# EAGLE design SensorBoard (EAGLE 6.4)
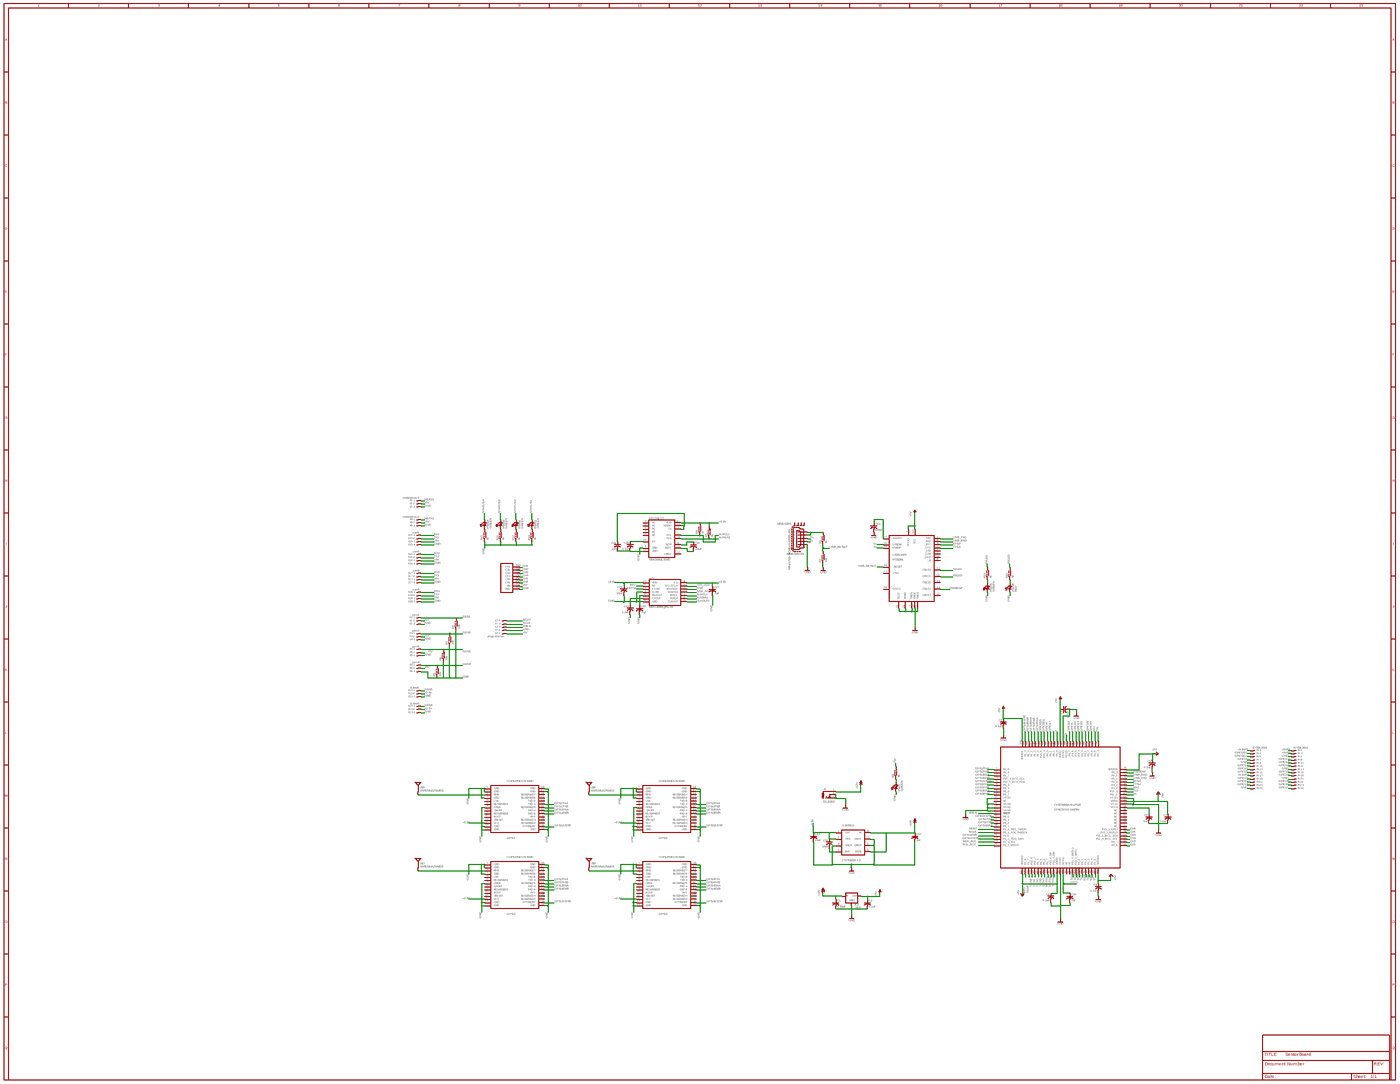
[diagram p0: schematic, sheet 1, overview]
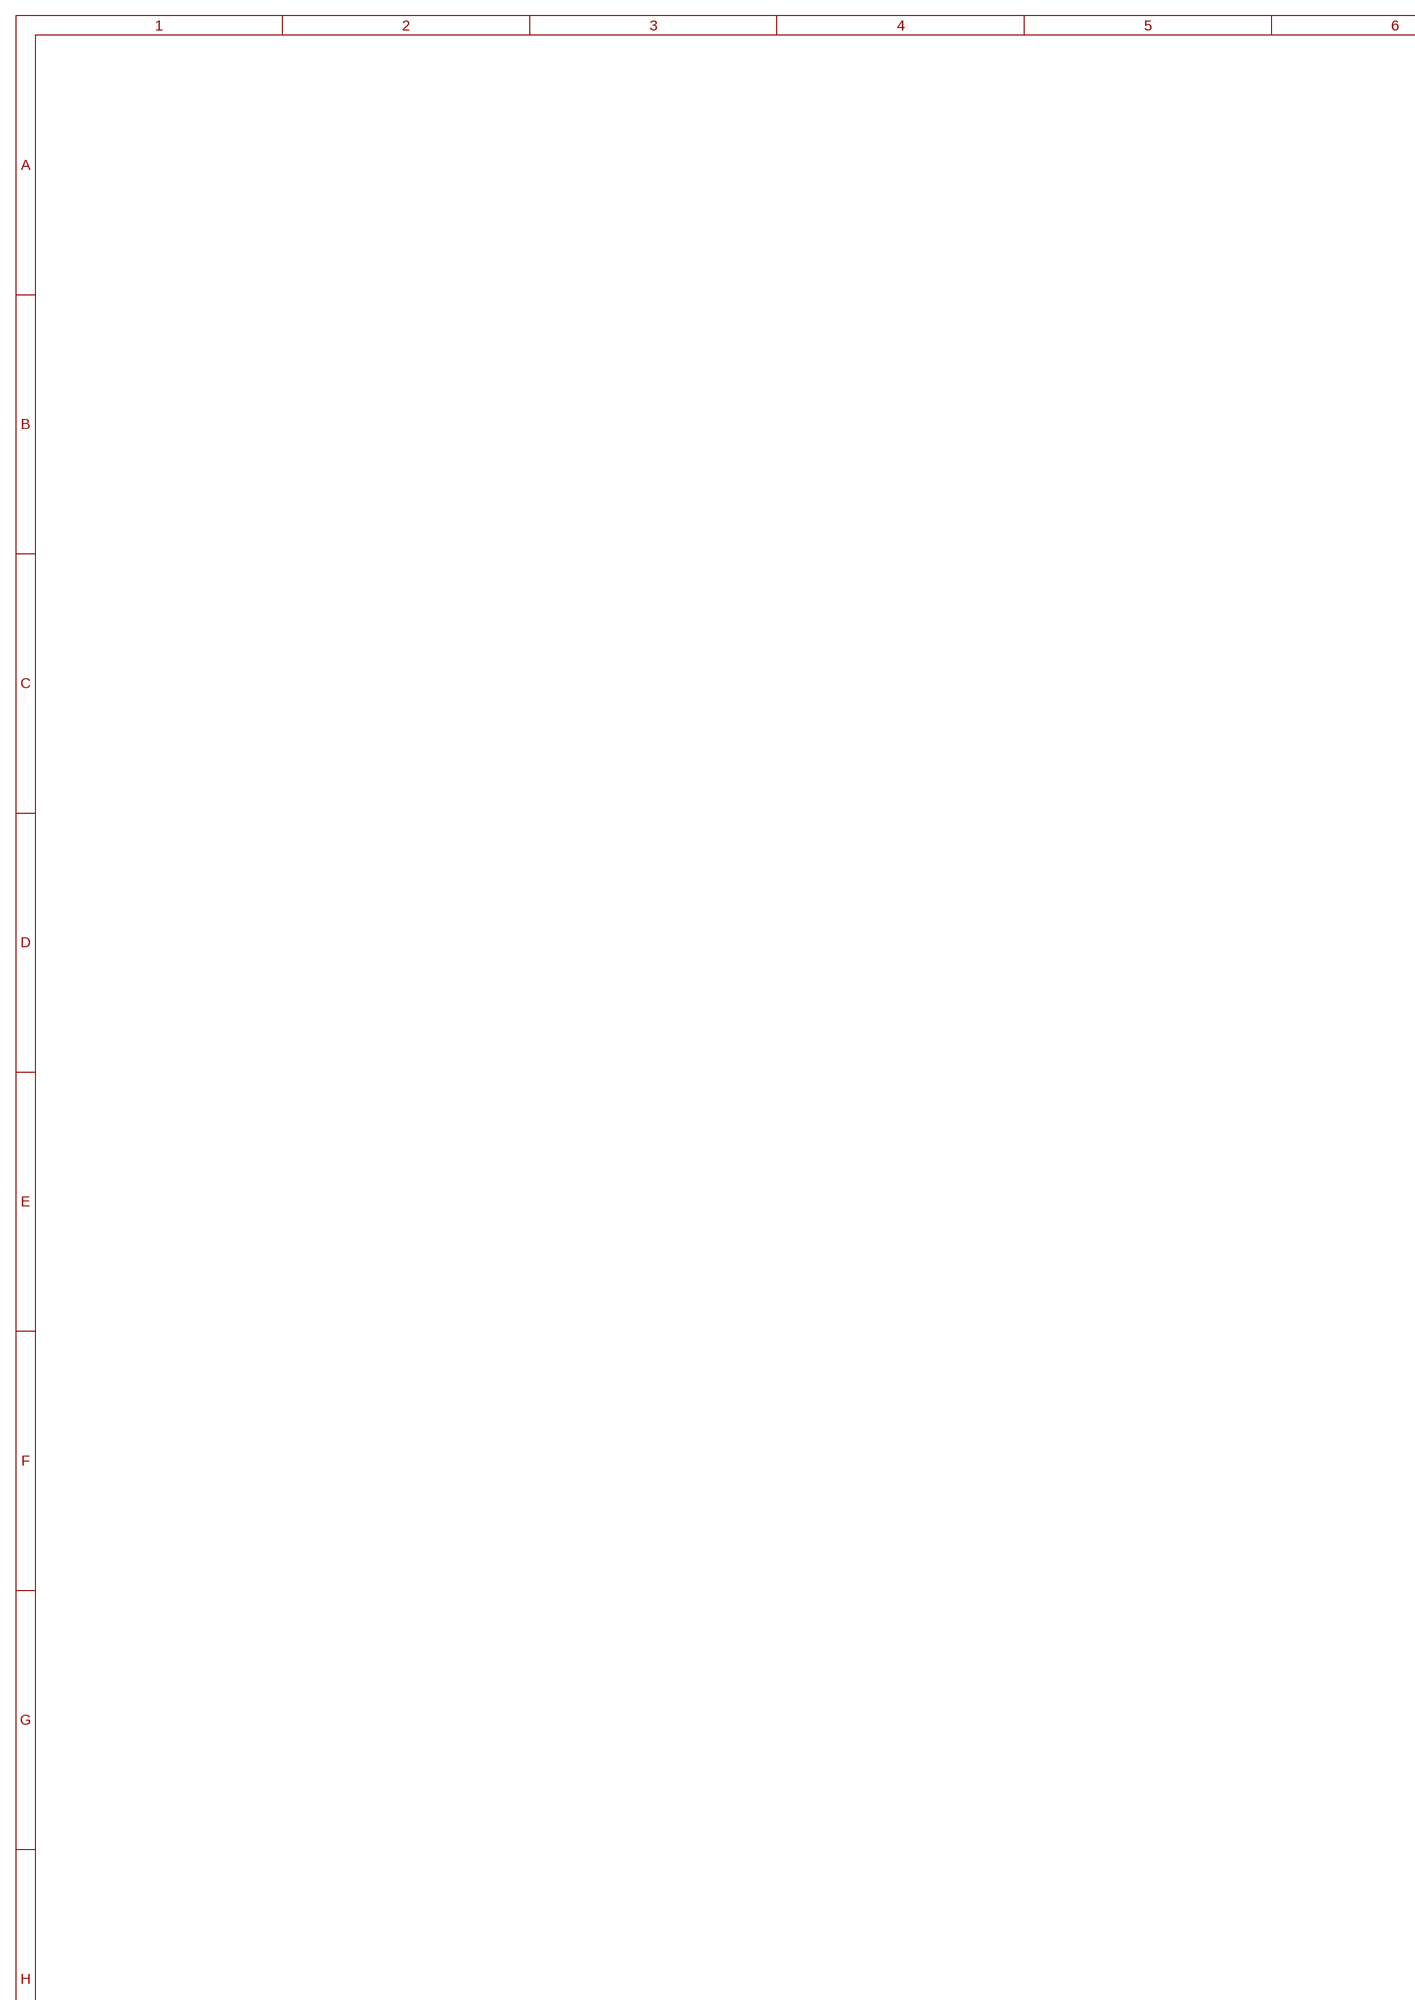
[diagram p1: schematic, sheet 1, part 1 of 8]
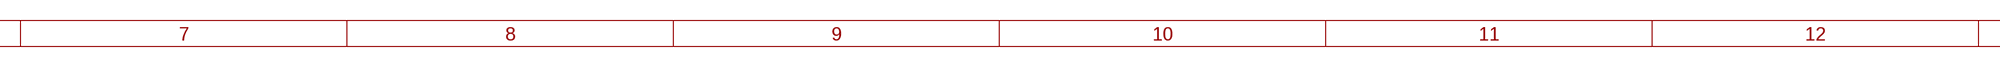
[diagram p2: schematic, sheet 1, part 2 of 8]
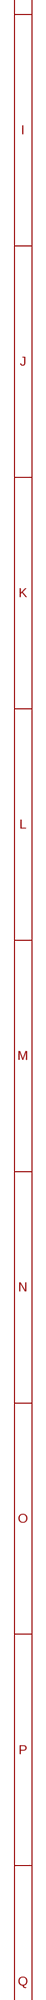
[diagram p3: schematic, sheet 1, part 3 of 8]
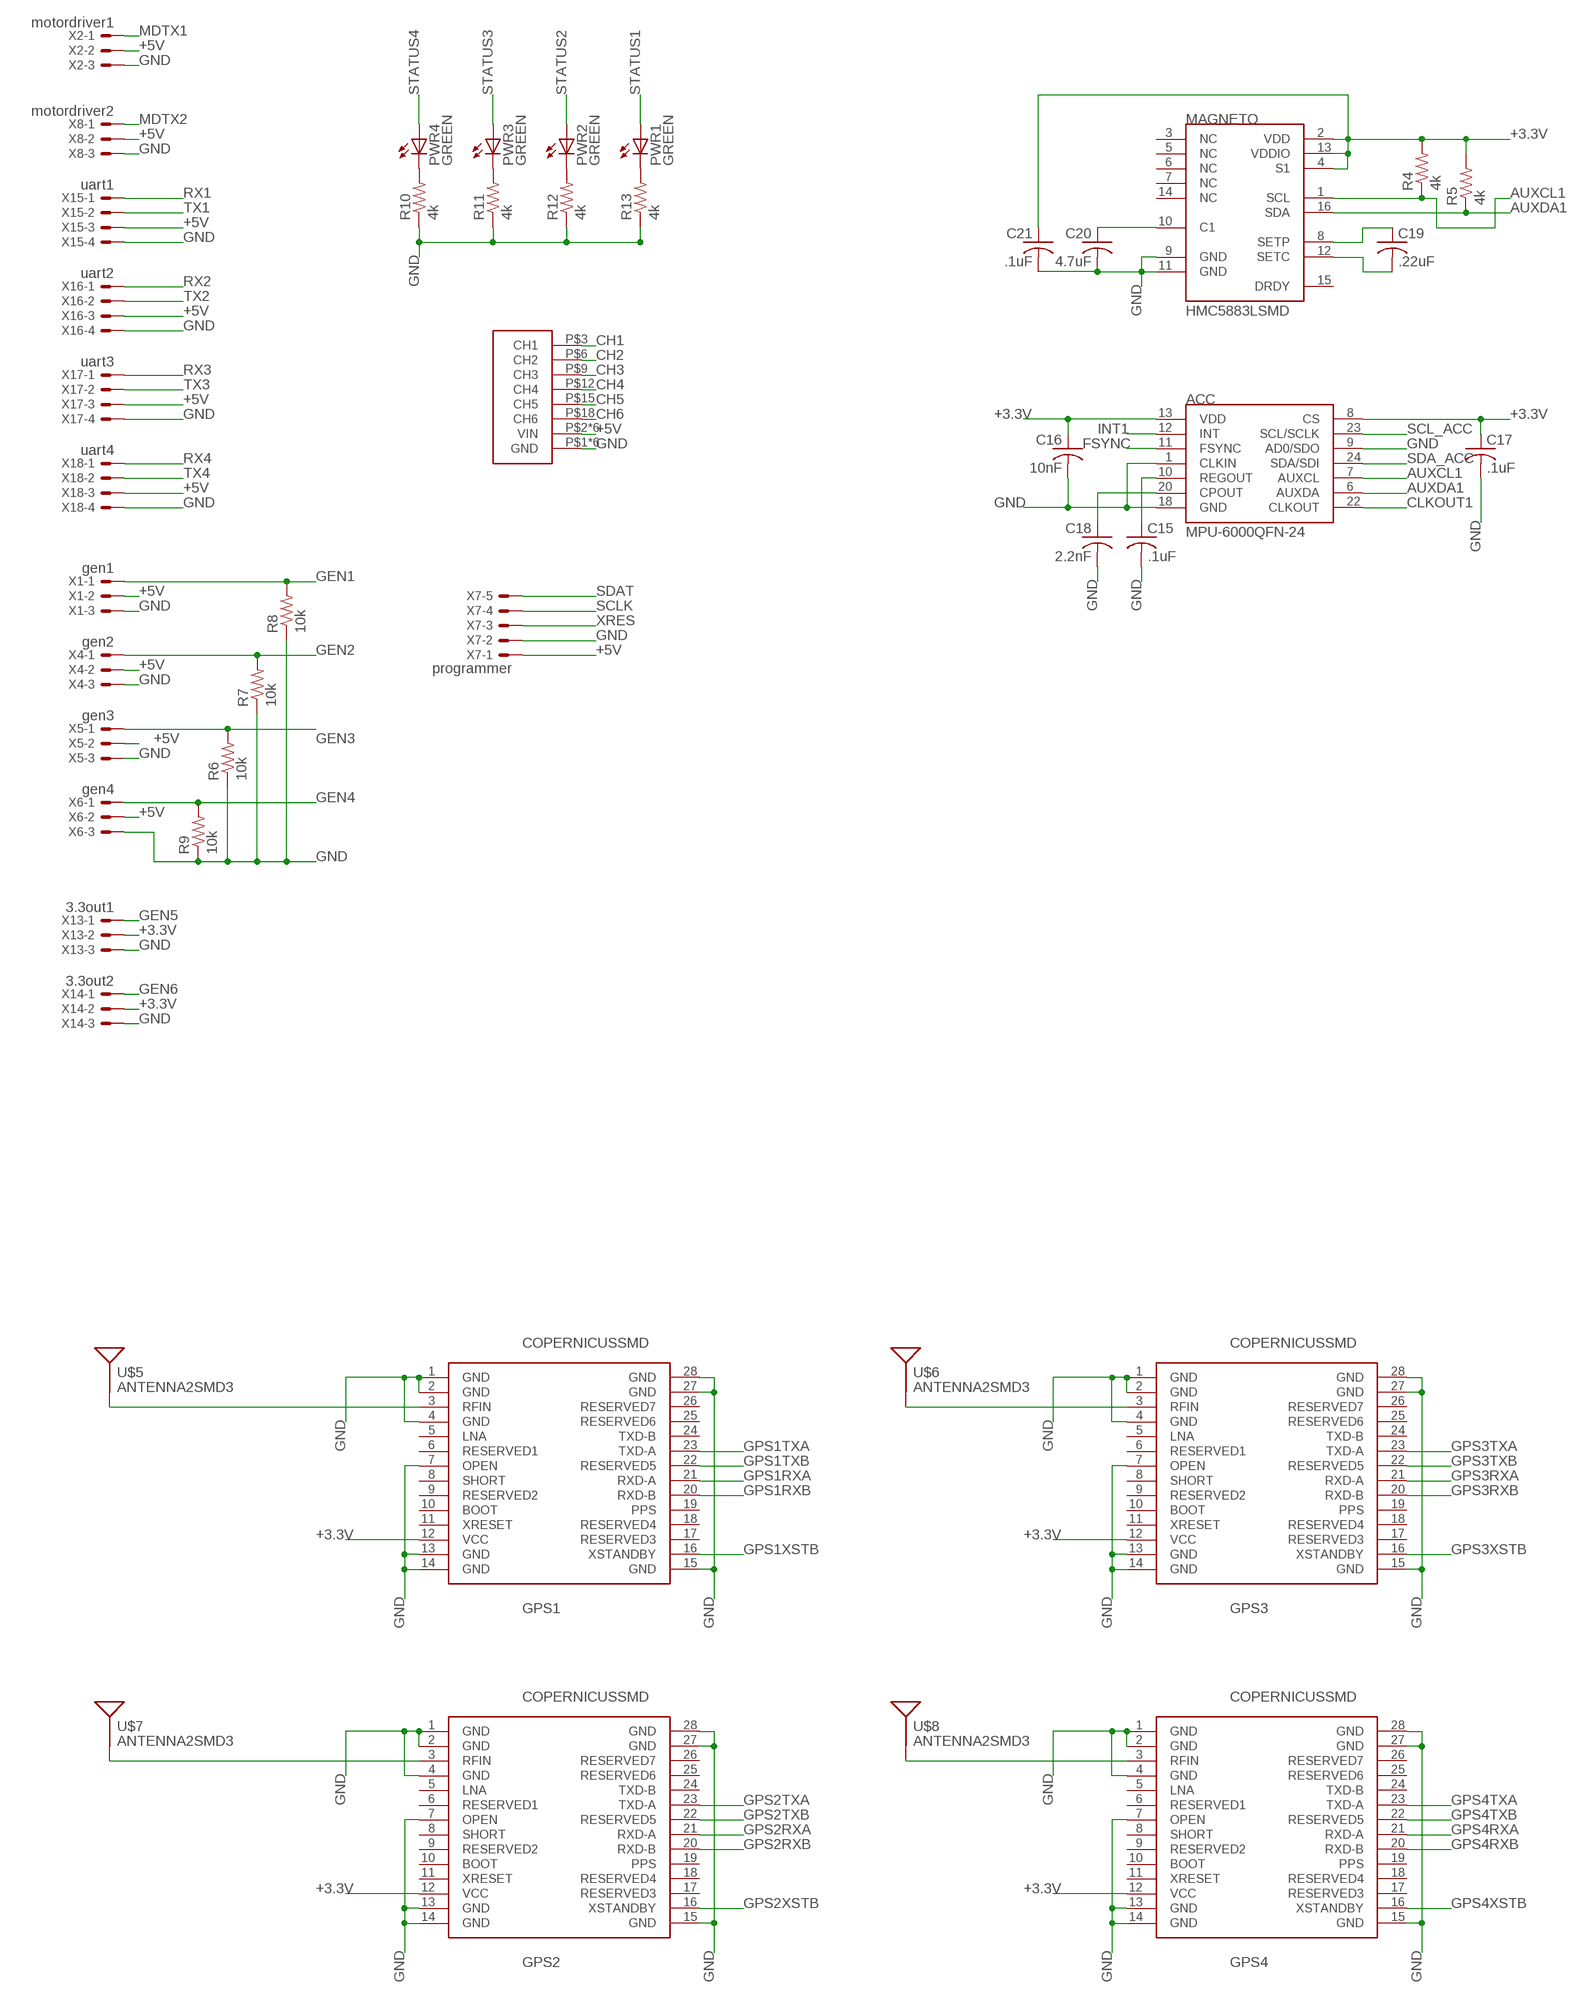
[diagram p4: schematic, sheet 1, part 4 of 8]
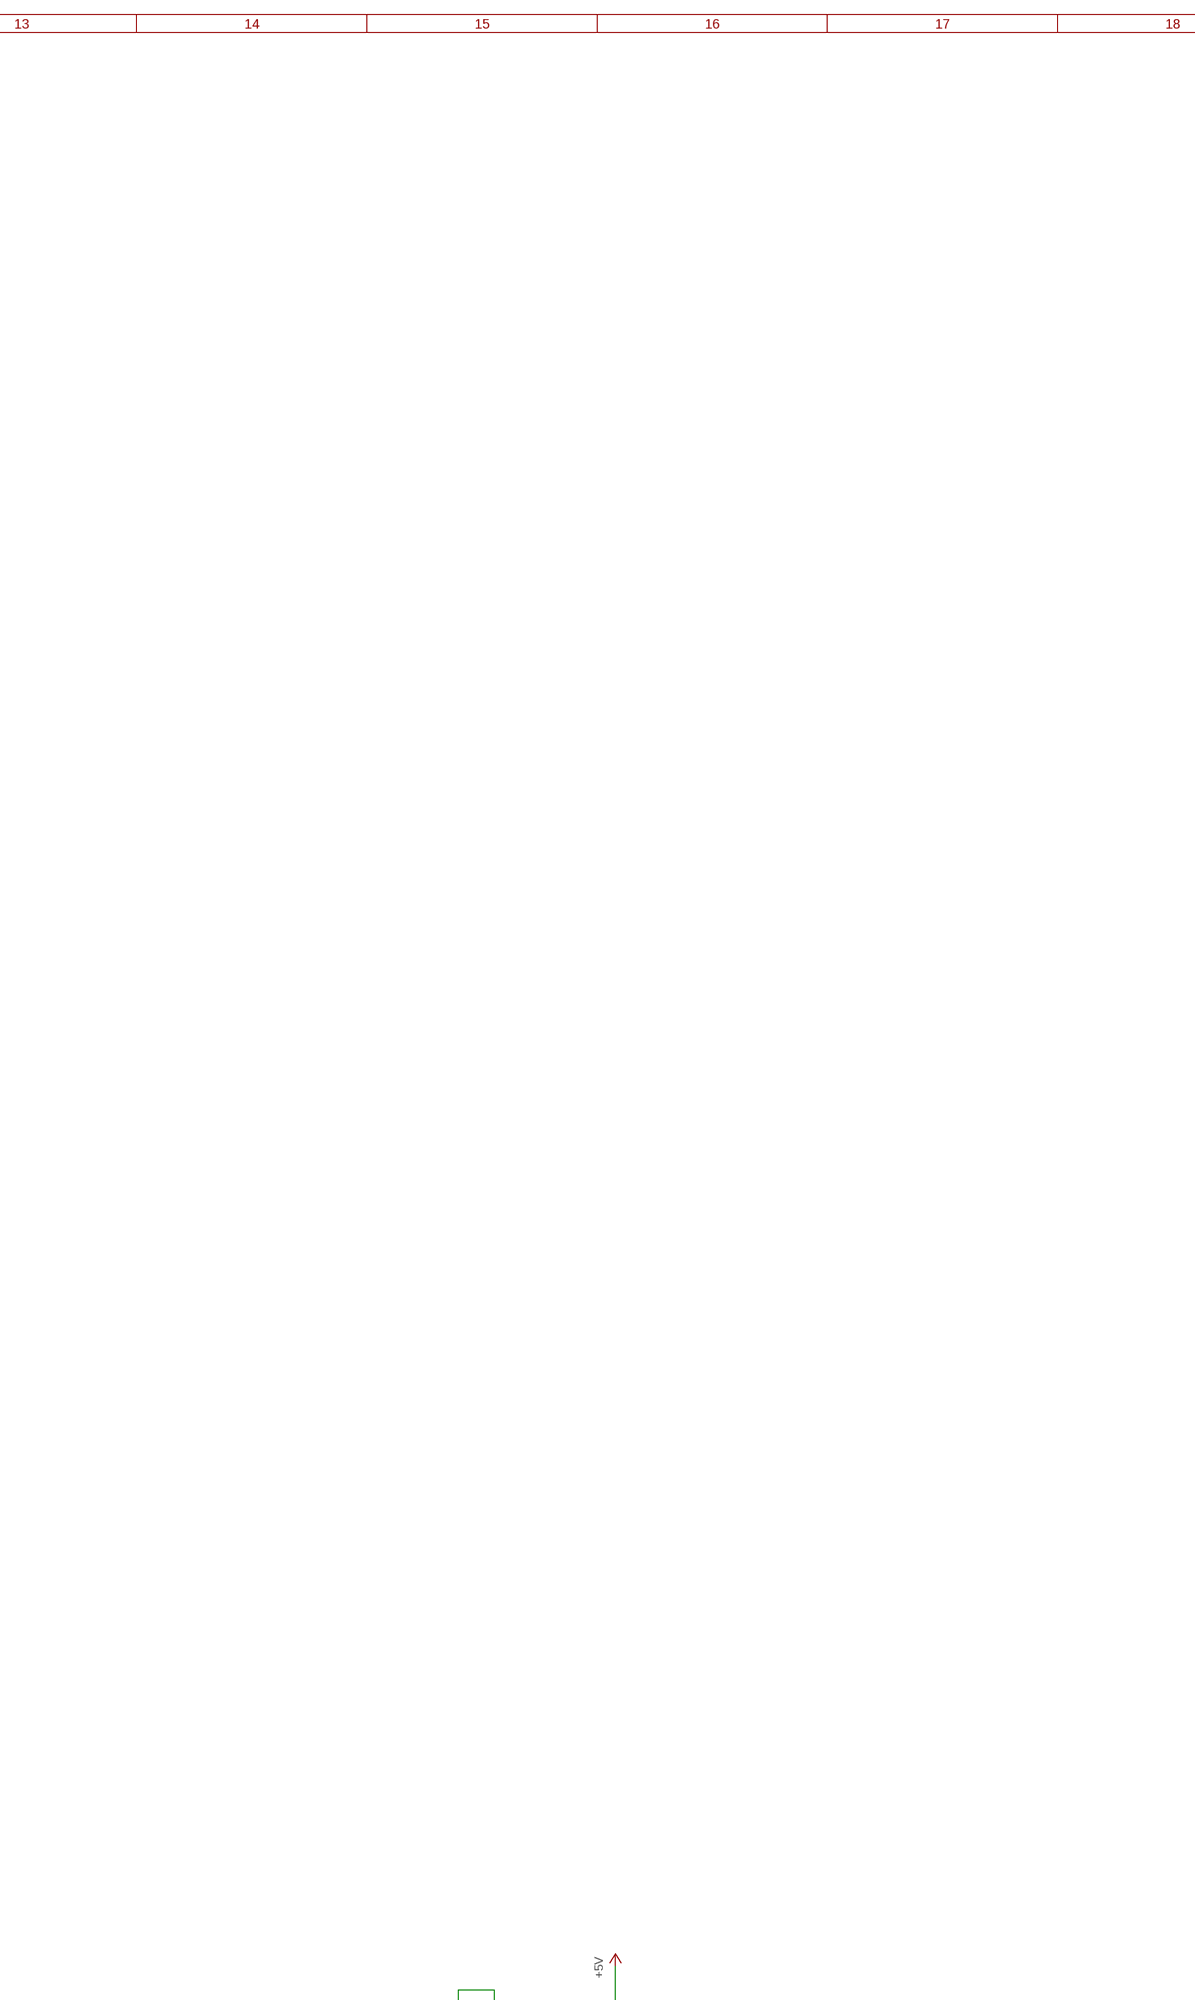
[diagram p5: schematic, sheet 1, part 5 of 8]
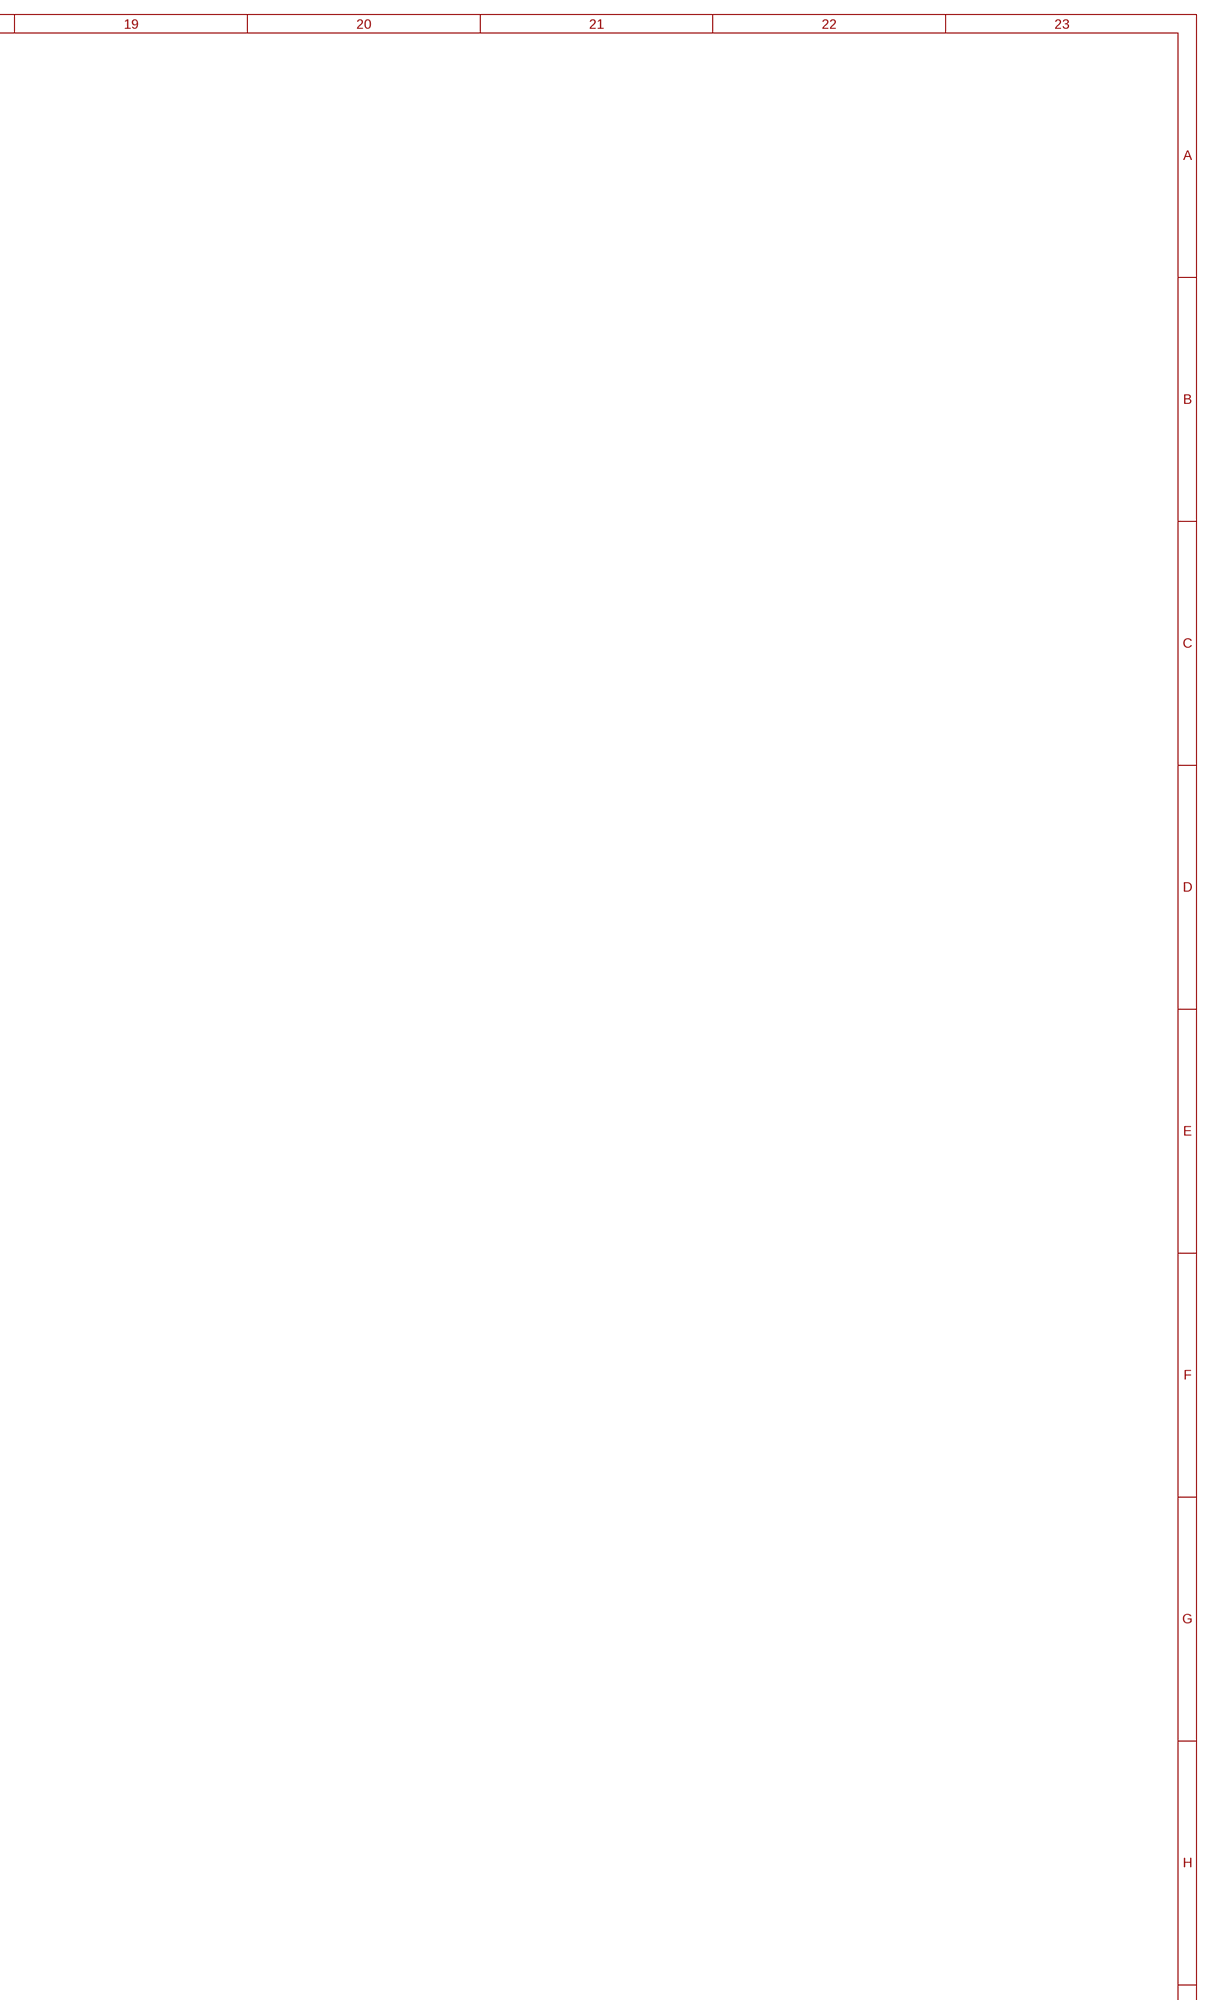
[diagram p6: schematic, sheet 1, part 6 of 8]
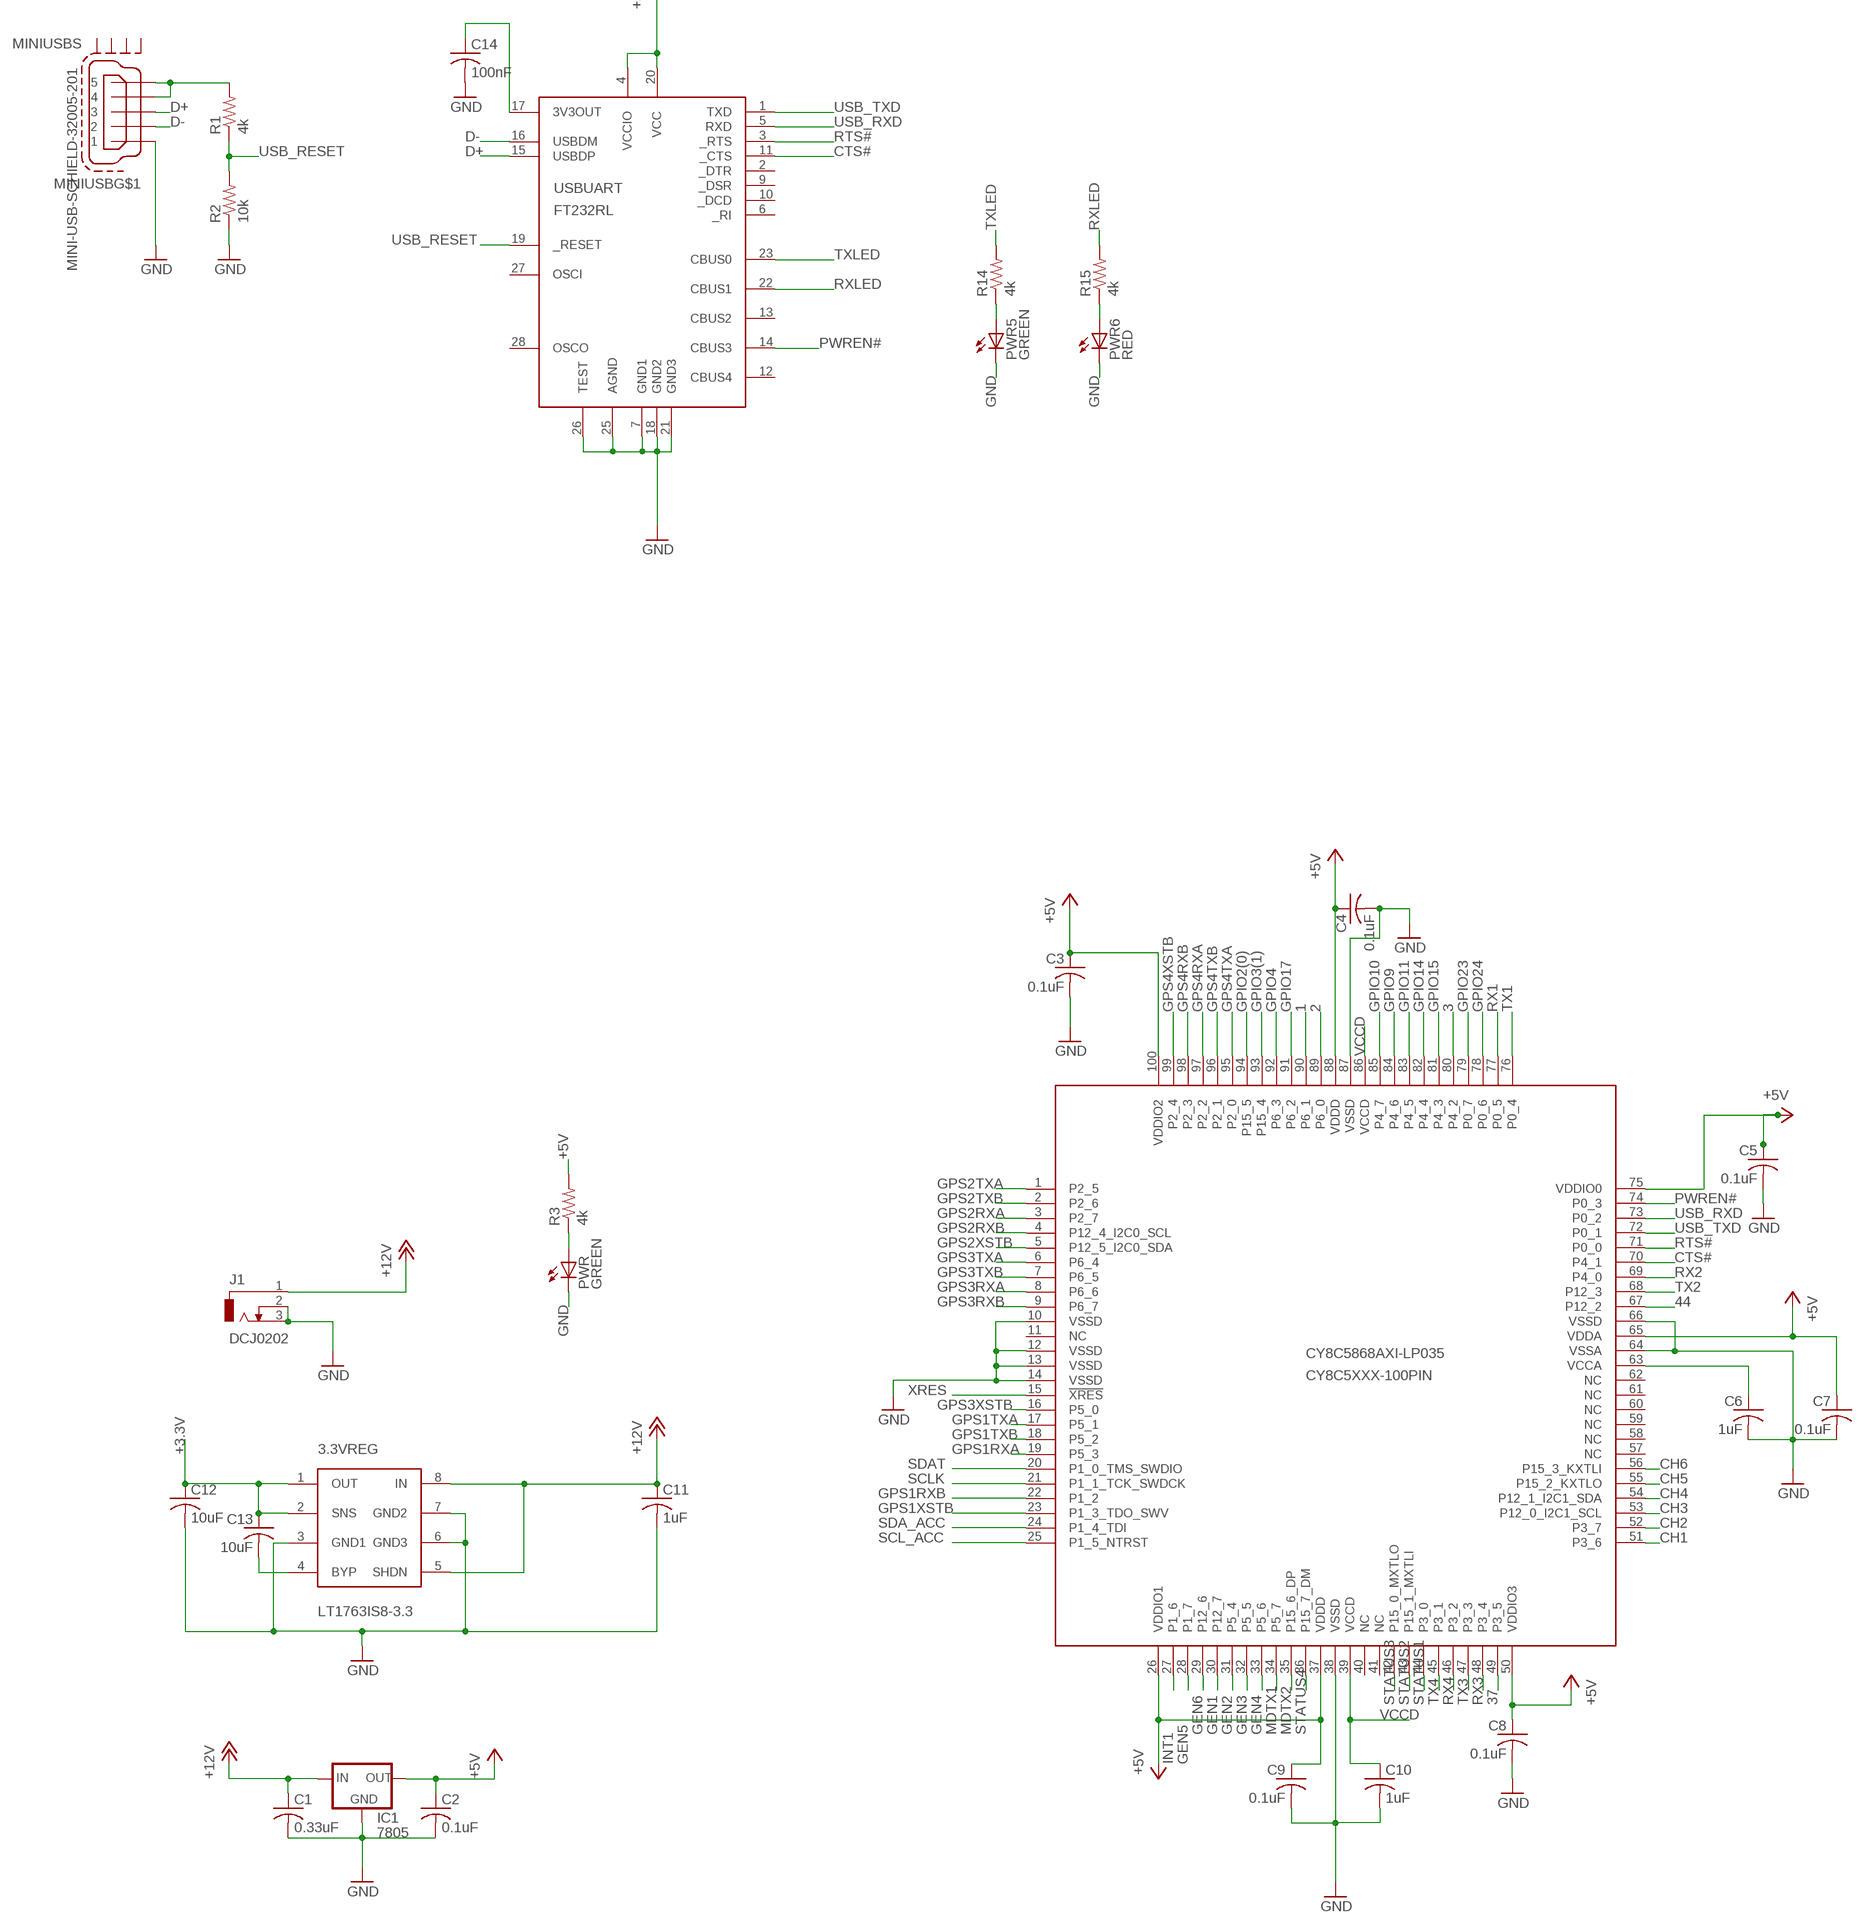
[diagram p7: schematic, sheet 1, part 7 of 8]
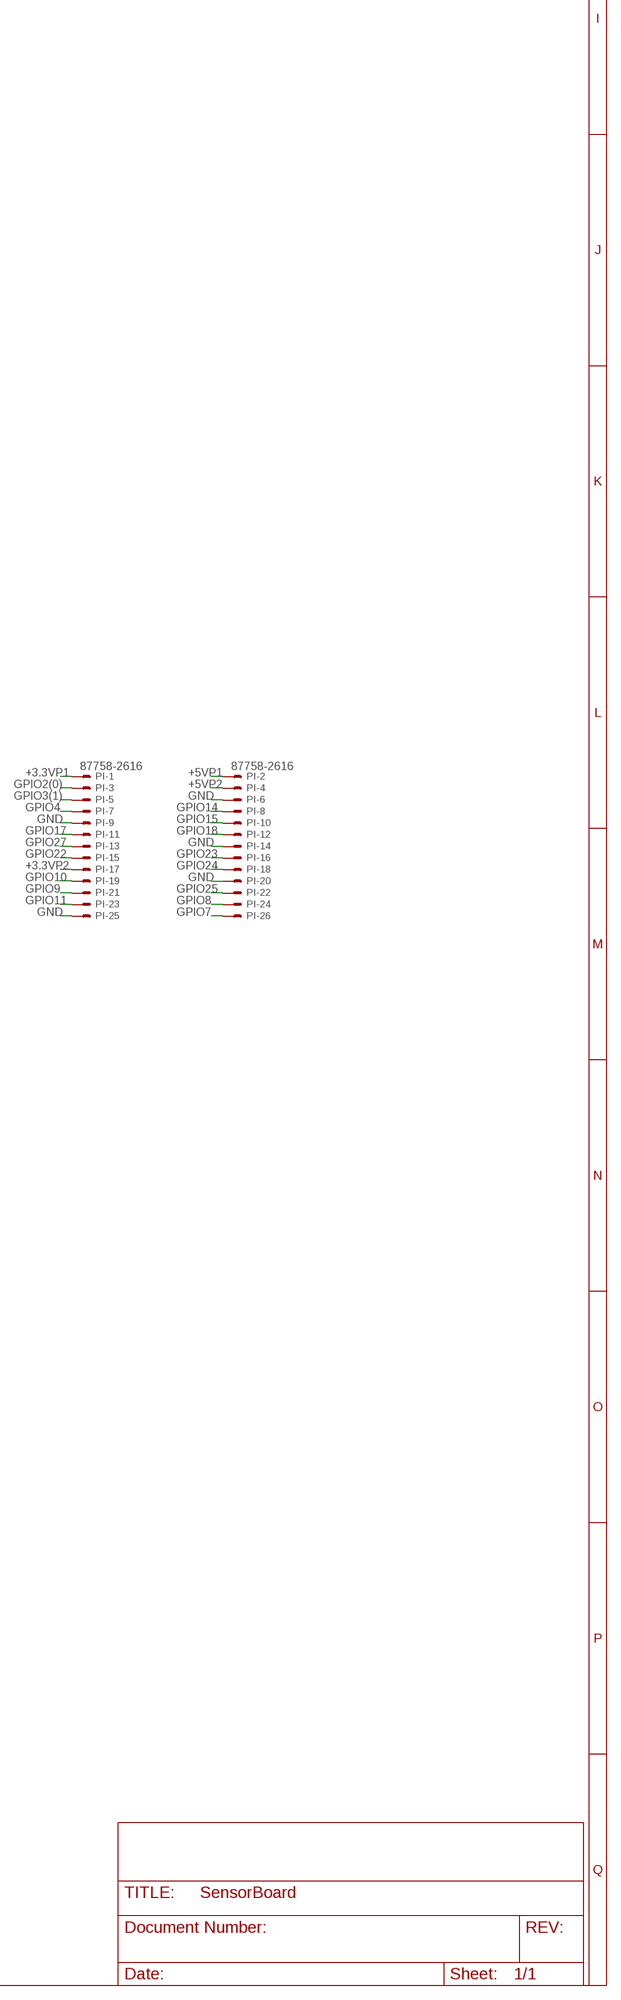
[diagram p8: schematic, sheet 1, part 8 of 8]

## Parts
3.3VREG  LT1763IS8-3.3  LT1763IS8  [LT1763IS8-SMD]
ACC  MPU-6000QFN-24  [QFN-24-TESTING]
C1  0.33uF  C-USC0402  [C0402]
C2  0.1uF  C-USC0402  [C0402]
C3  0.1uF  C-USC0402  [C0402]
C4  0.1uF  C-USC0402  [C0402]
C5  0.1uF  C-USC0402  [C0402]
C6  1uF  C-USC0402  [C0402]
C7  0.1uF  C-USC0402  [C0402]
C8  0.1uF  C-USC0402  [C0402]
C9  0.1uF  C-USC0402  [C0402]
C10  1uF  C-USC0402  [C0402]
C11  1uF  C-USC0402  [C0402]
C12  10uF  C-USC0402  [C0402]
C13  10uF  C-USC0402  [C0402]
C14  100nF  C-USC0402  [C0402]
C15  .1uF  C-USC0402  [C0402]
C16  10nF  C-USC0402  [C0402]
C17  .1uF  C-USC0402  [C0402]
C18  2.2nF  C-USC0402  [C0402]
C19  .22uF  C-USC0402  [C0402]
C20  4.7uF  C-USC0402  [C0402]
C21  .1uF  C-USC0402  [C0402]
CY8C5868AXI-LP035  CY8C5XXX-100PIN  [TQFP-14X14-100]
GPS1  COPERNICUSSMD  [COPERNICUS]
GPS2  COPERNICUSSMD  [COPERNICUS]
GPS3  COPERNICUSSMD  [COPERNICUS]
GPS4  COPERNICUSSMD  [COPERNICUS]
IC1  7805  78XXL  [78XXL]
J1  DCJ0202  [DCJ0202]
MAGNETO  HMC5883LSMD  [16LPCC]
MINIUSB  MINI-USB-SCHIELD-32005-201  [32005-201]
PI  87758-2616  [87758-2616]
PWR  GREEN  LEDCHIP-LED0603  [CHIP-LED0603]
PWR1  GREEN  LEDCHIP-LED0603  [CHIP-LED0603]
PWR2  GREEN  LEDCHIP-LED0603  [CHIP-LED0603]
PWR3  GREEN  LEDCHIP-LED0603  [CHIP-LED0603]
PWR4  GREEN  LEDCHIP-LED0603  [CHIP-LED0603]
PWR5  GREEN  LEDCHIP-LED0603  [CHIP-LED0603]
PWR6  RED  LEDCHIP-LED0603  [CHIP-LED0603]
R1  4k  R-US_0204/5  [0204/5]
R2  10k  R-US_0204/5  [0204/5]
R3  4k  R-US_0204/5  [0204/5]
R4  4k  R-US_0204/5  [0204/5]
R5  4k  R-US_0204/5  [0204/5]
R6  10k  R-US_0204/5  [0204/5]
R7  10k  R-US_0204/5  [0204/5]
R8  10k  R-US_0204/5  [0204/5]
R9  10k  R-US_0204/5  [0204/5]
R10  4k  R-US_0204/5  [0204/5]
R11  4k  R-US_0204/5  [0204/5]
R12  4k  R-US_0204/5  [0204/5]
R13  4k  R-US_0204/5  [0204/5]
R14  4k  R-US_0204/5  [0204/5]
R15  4k  R-US_0204/5  [0204/5]
RC  6-CHANNEL  [6-CHANNEL]
U$5  ANTENNA2SMD3  [ANTENNA-CHIP4]
U$6  ANTENNA2SMD3  [ANTENNA-CHIP4]
U$7  ANTENNA2SMD3  [ANTENNA-CHIP4]
U$8  ANTENNA2SMD3  [ANTENNA-CHIP4]
USBUART  FT232RL  [SSOP28DB]
X1  gen1  KK-156-3  [KK-156-3]
X2  motordriver1  KK-156-3  [KK-156-3]
X4  gen2  KK-156-3  [KK-156-3]
X5  gen3  KK-156-3  [KK-156-3]
X6  gen4  KK-156-3  [KK-156-3]
X7  programmer  KK-156-5  [KK-156-5]
X8  motordriver2  KK-156-3  [KK-156-3]
X13  3.3out1  KK-156-3  [KK-156-3]
X14  3.3out2  KK-156-3  [KK-156-3]
X15  uart1  KK-156-4  [KK-156-4]
X16  uart2  KK-156-4  [KK-156-4]
X17  uart3  KK-156-4  [KK-156-4]
X18  uart4  KK-156-4  [KK-156-4]

## Nets
1: CY8C5868AXI-LP035.90(P6_1)
2: CY8C5868AXI-LP035.89(P6_0)
3: CY8C5868AXI-LP035.80(P4_2)
37: CY8C5868AXI-LP035.49(P3_5)
44: CY8C5868AXI-LP035.67(P12_2)
+3.3V: 3.3VREG.1(OUT) 3.3VREG.2(SNS) ACC.8(CS) ACC.13(VDD) C12.1 C13.1 C16.1 C17.1 C21.1 GPS1.12(VCC) GPS2.12(VCC) GPS3.12(VCC) GPS4.12(VCC) MAGNETO.2(VDD) MAGNETO.4(S1) MAGNETO.13(VDDIO) R4.2 R5.2 X13.2 X14.2
+3.3VP1: PI.1
+3.3VP2: PI.17
+5V: C2.1 C3.1 C4.1 C5.1 C7.1 C8.1 C9.1 CY8C5868AXI-LP035.26(VDDIO1) CY8C5868AXI-LP035.37(VDDD) CY8C5868AXI-LP035.50(VDDIO3) CY8C5868AXI-LP035.65(VDDA) CY8C5868AXI-LP035.75(VDDIO0) CY8C5868AXI-LP035.88(VDDD) CY8C5868AXI-LP035.100(VDDIO2) IC1.OUT R3.2 RC.P$2(VIN) RC.P$5(VIN) RC.P$8(VIN) RC.P$11(VIN) RC.P$14(VIN) RC.P$17(VIN) USBUART.4(VCCIO) USBUART.20(VCC) X1.2 X2.2 X4.2 X5.2 X6.2 X7.1 X8.2 X15.3 X16.3 X17.3 X18.3
+5VP1: PI.2
+5VP2: PI.4
+12V: 3.3VREG.5(SHDN) 3.3VREG.8(IN) C1.1 C11.1 IC1.IN J1.1
AUXCL1: ACC.7(AUXCL) MAGNETO.1(SCL) R4.1
AUXDA1: ACC.6(AUXDA) MAGNETO.16(SDA) R5.1
CH1: CY8C5868AXI-LP035.51(P3_6) RC.P$3(CH1)
CH2: CY8C5868AXI-LP035.52(P3_7) RC.P$6(CH2)
CH3: CY8C5868AXI-LP035.53(P12_0_I2C1_SCL) RC.P$9(CH3)
CH4: CY8C5868AXI-LP035.54(P12_1_I2C1_SDA) RC.P$12(CH4)
CH5: CY8C5868AXI-LP035.55(P15_2_KXTLO) RC.P$15(CH5)
CH6: CY8C5868AXI-LP035.56(P15_3_KXTLI) RC.P$18(CH6)
CLKOUT1: ACC.22(CLKOUT)
CTS#: CY8C5868AXI-LP035.70(P4_1) USBUART.11(_CTS)
D+: MINIUSB.3 USBUART.15(USBDP)
D-: MINIUSB.2 USBUART.16(USBDM)
FSYNC: ACC.11(FSYNC)
GEN1: CY8C5868AXI-LP035.30(P12_7) R8.2 X1.1
GEN2: CY8C5868AXI-LP035.31(P5_4) R7.2 X4.1
GEN3: CY8C5868AXI-LP035.32(P5_5) R6.2 X5.1
GEN4: CY8C5868AXI-LP035.33(P5_6) R9.2 X6.1
GEN5: CY8C5868AXI-LP035.28(P1_7) X13.1
GEN6: CY8C5868AXI-LP035.29(P12_6) X14.1
GND: 3.3VREG.3(GND1) 3.3VREG.6(GND3) 3.3VREG.7(GND2) ACC.1(CLKIN) ACC.9(AD0/SDO) ACC.18(GND) C1.2 C2.2 C3.2 C4.2 C5.2 C6.2 C7.2 C8.2 C9.2 C10.2 C11.2 C12.2 C14.2 C15.2 C16.2 C17.2 C18.2 C20.2 C21.2 CY8C5868AXI-LP035.10(VSSD) CY8C5868AXI-LP035.12(VSSD) CY8C5868AXI-LP035.13(VSSD) CY8C5868AXI-LP035.14(VSSD) CY8C5868AXI-LP035.38(VSSD) CY8C5868AXI-LP035.64(VSSA) CY8C5868AXI-LP035.66(VSSD) CY8C5868AXI-LP035.87(VSSD) GPS1.1(GND) GPS1.2(GND) GPS1.4(GND) GPS1.7(OPEN) GPS1.13(GND) GPS1.14(GND) GPS1.15(GND) GPS1.27(GND) GPS1.28(GND) GPS2.1(GND) GPS2.2(GND) GPS2.4(GND) GPS2.7(OPEN) GPS2.13(GND) GPS2.14(GND) GPS2.15(GND) GPS2.27(GND) GPS2.28(GND) GPS3.1(GND) GPS3.2(GND) GPS3.4(GND) GPS3.7(OPEN) GPS3.13(GND) GPS3.14(GND) GPS3.15(GND) GPS3.27(GND) GPS3.28(GND) GPS4.1(GND) GPS4.2(GND) GPS4.4(GND) GPS4.7(OPEN) GPS4.13(GND) GPS4.14(GND) GPS4.15(GND) GPS4.27(GND) GPS4.28(GND) IC1.GND J1.2 J1.3 MAGNETO.9(GND) MAGNETO.11(GND) MINIUSB.1 PI.6 PI.9 PI.14 PI.20 PI.25 PWR5.C PWR6.C PWR.C R2.1 R6.1 R7.1 R8.1 R9.1 R10.1 R11.1 R12.1 R13.1 RC.P$1(GND) RC.P$4(GND) RC.P$7(GND) RC.P$10(GND) RC.P$13(GND) RC.P$16(GND) USBUART.7(GND1) USBUART.18(GND2) USBUART.21(GND3) USBUART.25(AGND) USBUART.26(TEST) X1.3 X2.3 X4.3 X5.3 X6.3 X7.2 X8.3 X13.3 X14.3 X15.4 X16.4 X17.4 X18.4
GPIO2(0): CY8C5868AXI-LP035.94(P15_5) PI.3
GPIO3(1): CY8C5868AXI-LP035.93(P15_4) PI.5
GPIO4: CY8C5868AXI-LP035.92(P6_3) PI.7
GPIO7: PI.26
GPIO8: PI.24
GPIO9: CY8C5868AXI-LP035.84(P4_6) PI.21
GPIO10: CY8C5868AXI-LP035.85(P4_7) PI.19
GPIO11: CY8C5868AXI-LP035.83(P4_5) PI.23
GPIO14: CY8C5868AXI-LP035.82(P4_4) PI.8
GPIO15: CY8C5868AXI-LP035.81(P4_3) PI.10
GPIO17: CY8C5868AXI-LP035.91(P6_2) PI.11
GPIO18: PI.12
GPIO22: PI.15
GPIO23: CY8C5868AXI-LP035.79(P0_7) PI.16
GPIO24: CY8C5868AXI-LP035.78(P0_6) PI.18
GPIO25: PI.22
GPIO27: PI.13
GPS1RXA: CY8C5868AXI-LP035.19(P5_3) GPS1.21(RXD-A)
GPS1RXB: CY8C5868AXI-LP035.22(P1_2) GPS1.20(RXD-B)
GPS1TXA: CY8C5868AXI-LP035.17(P5_1) GPS1.23(TXD-A)
GPS1TXB: CY8C5868AXI-LP035.18(P5_2) GPS1.22(RESERVED5)
GPS1XSTB: CY8C5868AXI-LP035.23(P1_3_TDO_SWV) GPS1.16(XSTANDBY)
GPS2RXA: CY8C5868AXI-LP035.3(P2_7) GPS2.21(RXD-A)
GPS2RXB: CY8C5868AXI-LP035.4(P12_4_I2C0_SCL) GPS2.20(RXD-B)
GPS2TXA: CY8C5868AXI-LP035.1(P2_5) GPS2.23(TXD-A)
GPS2TXB: CY8C5868AXI-LP035.2(P2_6) GPS2.22(RESERVED5)
GPS2XSTB: CY8C5868AXI-LP035.5(P12_5_I2C0_SDA) GPS2.16(XSTANDBY)
GPS3RXA: CY8C5868AXI-LP035.8(P6_6) GPS3.21(RXD-A)
GPS3RXB: CY8C5868AXI-LP035.9(P6_7) GPS3.20(RXD-B)
GPS3TXA: CY8C5868AXI-LP035.6(P6_4) GPS3.23(TXD-A)
GPS3TXB: CY8C5868AXI-LP035.7(P6_5) GPS3.22(RESERVED5)
GPS3XSTB: CY8C5868AXI-LP035.16(P5_0) GPS3.16(XSTANDBY)
GPS4RXA: CY8C5868AXI-LP035.97(P2_2) GPS4.21(RXD-A)
GPS4RXB: CY8C5868AXI-LP035.98(P2_3) GPS4.20(RXD-B)
GPS4TXA: CY8C5868AXI-LP035.95(P2_0) GPS4.23(TXD-A)
GPS4TXB: CY8C5868AXI-LP035.96(P2_1) GPS4.22(RESERVED5)
GPS4XSTB: CY8C5868AXI-LP035.99(P2_4) GPS4.16(XSTANDBY)
INT1: ACC.12(INT) CY8C5868AXI-LP035.27(P1_6)
MDTX1: CY8C5868AXI-LP035.34(P5_7) X2.1
MDTX2: CY8C5868AXI-LP035.35(P15_6_DP) X8.1
N$1: C6.1 CY8C5868AXI-LP035.63(VCCA)
N$2: 3.3VREG.4(BYP) C13.2
N$3: GPS1.3(RFIN) U$5.SIG(SIGNAL)
N$4: PWR.A R3.1
N$5: C14.1 USBUART.17(3V3OUT)
N$6: MINIUSB.4 MINIUSB.5 R1.2
N$7: ACC.10(REGOUT) C15.1
N$8: ACC.20(CPOUT) C18.1
N$9: PWR4.C R10.2
N$10: GPS2.3(RFIN) U$7.SIG(SIGNAL)
N$11: C19.2 MAGNETO.12(SETC)
N$12: GPS3.3(RFIN) U$6.SIG(SIGNAL)
N$13: GPS4.3(RFIN) U$8.SIG(SIGNAL)
N$15: C19.1 MAGNETO.8(SETP)
N$16: C20.1 MAGNETO.10(C1)
N$17: PWR3.C R11.2
N$18: PWR2.C R12.2
N$19: PWR1.C R13.2
N$20: PWR5.A R14.1
N$21: PWR6.A R15.1
PWREN#: CY8C5868AXI-LP035.74(P0_3) USBUART.14(CBUS3)
RTS#: CY8C5868AXI-LP035.71(P0_0) USBUART.3(_RTS)
RX1: CY8C5868AXI-LP035.77(P0_5) X15.1
RX2: CY8C5868AXI-LP035.69(P4_0) X16.1
RX3: CY8C5868AXI-LP035.48(P3_4) X17.1
RX4: CY8C5868AXI-LP035.46(P3_2) X18.1
RXLED: R15.2 USBUART.22(CBUS1)
SCL_ACC: ACC.23(SCL/SCLK) CY8C5868AXI-LP035.25(P1_5_NTRST)
SCLK: CY8C5868AXI-LP035.21(P1_1_TCK_SWDCK) X7.4
SDA_ACC: ACC.24(SDA/SDI) CY8C5868AXI-LP035.24(P1_4_TDI)
SDAT: CY8C5868AXI-LP035.20(P1_0_TMS_SWDIO) X7.5
STATUS1: CY8C5868AXI-LP035.44(P3_0) PWR1.A
STATUS2: CY8C5868AXI-LP035.43(P15_1_MXTLI) PWR2.A
STATUS3: CY8C5868AXI-LP035.42(P15_0_MXTLO) PWR3.A
STATUS4: CY8C5868AXI-LP035.36(P15_7_DM) PWR4.A
TX1: CY8C5868AXI-LP035.76(P0_4) X15.2
TX2: CY8C5868AXI-LP035.68(P12_3) X16.2
TX3: CY8C5868AXI-LP035.47(P3_3) X17.2
TX4: CY8C5868AXI-LP035.45(P3_1) X18.2
TXLED: R14.2 USBUART.23(CBUS0)
USB_RESET: R1.1 R2.2 USBUART.19(_RESET)
USB_RXD: CY8C5868AXI-LP035.73(P0_2) USBUART.5(RXD)
USB_TXD: CY8C5868AXI-LP035.72(P0_1) USBUART.1(TXD)
VCCD: C10.1 CY8C5868AXI-LP035.39(VCCD) CY8C5868AXI-LP035.86(VCCD)
XRES: CY8C5868AXI-LP035.15(!XRES!) X7.3
Unconnected: CY8C5868AXI-LP035.11(NC) CY8C5868AXI-LP035.40(NC) CY8C5868AXI-LP035.41(NC) CY8C5868AXI-LP035.57(NC) CY8C5868AXI-LP035.58(NC) CY8C5868AXI-LP035.59(NC) CY8C5868AXI-LP035.60(NC) CY8C5868AXI-LP035.61(NC) CY8C5868AXI-LP035.62(NC) GPS1.5(LNA) GPS1.6(RESERVED1) GPS1.8(SHORT) GPS1.9(RESERVED2) GPS1.10(BOOT) GPS1.11(XRESET) GPS1.17(RESERVED3) GPS1.18(RESERVED4) GPS1.19(PPS) GPS1.24(TXD-B) GPS1.25(RESERVED6) GPS1.26(RESERVED7) GPS2.5(LNA) GPS2.6(RESERVED1) GPS2.8(SHORT) GPS2.9(RESERVED2) GPS2.10(BOOT) GPS2.11(XRESET) GPS2.17(RESERVED3) GPS2.18(RESERVED4) GPS2.19(PPS) GPS2.24(TXD-B) GPS2.25(RESERVED6) GPS2.26(RESERVED7) GPS3.5(LNA) GPS3.6(RESERVED1) GPS3.8(SHORT) GPS3.9(RESERVED2) GPS3.10(BOOT) GPS3.11(XRESET) GPS3.17(RESERVED3) GPS3.18(RESERVED4) GPS3.19(PPS) GPS3.24(TXD-B) GPS3.25(RESERVED6) GPS3.26(RESERVED7) GPS4.5(LNA) GPS4.6(RESERVED1) GPS4.8(SHORT) GPS4.9(RESERVED2) GPS4.10(BOOT) GPS4.11(XRESET) GPS4.17(RESERVED3) GPS4.18(RESERVED4) GPS4.19(PPS) GPS4.24(TXD-B) GPS4.25(RESERVED6) GPS4.26(RESERVED7) MAGNETO.3(NC) MAGNETO.5(NC) MAGNETO.6(NC) MAGNETO.7(NC) MAGNETO.14(NC) MAGNETO.15(DRDY) MINIUSB.M1(S:S1) MINIUSB.M2(S:S2) MINIUSB.M3(S:S3) MINIUSB.M4(S:S4) USBUART.2(_DTR) USBUART.6(_RI) USBUART.9(_DSR) USBUART.10(_DCD) USBUART.12(CBUS4) USBUART.13(CBUS2) USBUART.27(OSCI) USBUART.28(OSCO)

## Library data of the parts
3.3VREG = MYPARTS:LT1763IS8
ACC = SparkFun-Sensors:MPU-6000: MPU-6000 - I2C address is 0x68 with AD0 low and 0x69 with AD0 high.
C1-C21 = rcl:C-US: CAPACITOR, American symbol
CY8C5868AXI-LP035 = cypress_psoc_V1_0:CY8C5XXX-100PIN: Cypress PSoC® 5 - Programmable System on Chip, ARM Cortex-M3 Based Source Data: http://www.cypress.com/?mpn=CY8C5588AXI-060 LBR Source: http://www.westmarkelectronics.com Thomas W. Moxon Director of Engineering www.westmarkelectronics.com; MPN: CY8C5588AXI-060
GPS1-GPS4 = SparkFun-RF:COPERNICUS: Copernicus II GPS- Trimble recommended layout and paste layer. Footprint production proven. Spark Fun Electronics SKU : GPS-07951
IC1 = v-reg:78XXL: VOLTAGE REGULATOR
J1 = con-jack:DCJ0202: DC POWER JACK Source: DCJ0202.pdf; OC_FARNELL: unknown; OC_NEWARK: unknown
MAGNETO = SparkFun-Sensors:HMC5883L: 3 Axis Digital Compass IC
MINIUSB = con-cypressindustries:MINI-USB-SCHIELD-: MINI USB-B Conector Source: www.cypressindustries.com; OC_FARNELL: unknown; OC_NEWARK: unknown
PI = con-molex:87758-2616: 26 Pin - 2mm Dual Row Single Wafer, Vertical T/H HDR Source: http://www.molex.com/pdm_docs/sd/877580616_sd.pdf; MPN: 87758-2616; OC_FARNELL: unknown; OC_NEWARK: 94M1541
PWR PWR1-PWR6 = led:LED: LED OSRAM: - CHIPLED LG R971, LG N971, LY N971, LG Q971, LY Q971, LO R971, LY R971 LH N974, LH R974 LS Q976, LO Q976, LY Q976 LO Q996 - Hyper CHIPLED LW Q18S LB Q993, LB Q99A, LB R99A - SideLED LS A670, LO A670, LY A670, LG A670, LP A670 LB A673, LV A673, LT A673, LW A673 LH A674 LY A675 LS A676, LA A676, LO A676, LY A676, LW A676 LS A679, LY A679, LG A679 - Hyper Micro SIDELED® LS Y876, LA Y876, LO Y876, LY Y876 LT Y87S - SmartLED LW L88C, LW L88S LB L89C, LB L89S, LG L890 LS L89K, LO L89K, LY L89K LS L896, LA L896, LO L896, LY L896 - TOPLED LS T670, LO T670, LY T670, LG T670, LP T670 LSG T670, LSP T670, LSY T670, LOP T670, LYG T670 LG T671, LOG T671, LSG T671 LB T673, LV T673, LT T673, LW T673 LH T674 LS T676, LA T676, LO T676, LY T676, LB T676, LH T676, LSB T676, LW T676 LB T67C, LV T67C, LT T67C, LS T67K, LO T67K, LY T67K, LW E67C LS E67B, LA E67B, LO E67B, LY E67B, LB E67C, LV E67C, LT E67C LW T67C LS T679, LY T679, LG T679 LS T770, LO T770, LY T770, LG T770, LP T770 LB T773, LV T773, LT T773, LW T773 LH T774 LS E675, LA E675, LY E675, LS T675 LS T776, LA T776, LO T776, LY T776, LB T776 LHGB T686 LT T68C, LB T68C - Hyper Mini TOPLED® LB M676 - Mini TOPLED Santana® LG M470 LS M47K, LO M47K, LY M47K Source: http://www.osram.convergy.de LUXEON: - LUMILED® LXK2-PW12-R00, LXK2-PW12-S00, LXK2-PW14-U00, LXK2-PW14-V00 LXK2-PM12-R00, LXK2-PM12-S00, LXK2-PM14-U00 LXK2-PE12-Q00, LXK2-PE12-R00, LXK2-PE12-S00, LXK2-PE14-T00, LXK2-PE14-U00 LXK2-PB12-K00, LXK2-PB12-L00, LXK2-PB12-M00, LXK2-PB14-N00, LXK2-PB14-P00, LXK2-PB14-Q00 LXK2-PR12-L00, LXK2-PR12-M00, LXK2-PR14-Q00, LXK2-PR14-R00 LXK2-PD12-Q00, LXK2-PD12-R00, LXK2-PD12-S00 LXK2-PH12-R00, LXK2-PH12-S00 LXK2-PL12-P00, LXK2-PL12-Q00, LXK2-PL12-R00 Source: www.luxeon.com KINGBRIGHT: KA-3528ASYC Source: www.kingbright.com
R1-R15 = resistor:R-US_: RESISTOR, American symbol
RC = RCRECIEVER:6-CHANNEL
U$5-U$8 = SparkFun-RF:ANTENNA2: Chip antenna Single endded antenna. Common with smaller chip antennas. CHIP4 package is the GPS Chip Antenna SKU: GPS-08418. CHIP5 package is 2.4GHz chip antenna SKU: WRL-00144.
USBUART = ftdichip-3:FT232RL: USB UART 4th Generation USB UART (USB <-> Serial) Controller
X1 X2 X4-X6 X8 X13 X14 = con-molex:KK-156-3: KK 156 HEADER Source: http://www.molex.com/pdm_docs/sd/026604100_sd.pdf; OC_FARNELL: unknown; OC_NEWARK: unknown
X7 = con-molex:KK-156-5: KK 156 HEADER Source: http://www.molex.com/pdm_docs/sd/026604100_sd.pdf; OC_FARNELL: unknown; OC_NEWARK: unknown
X15-X18 = con-molex:KK-156-4: KK 156 HEADER Source: http://www.molex.com/pdm_docs/sd/026604100_sd.pdf; OC_FARNELL: unknown; OC_NEWARK: unknown

## Board
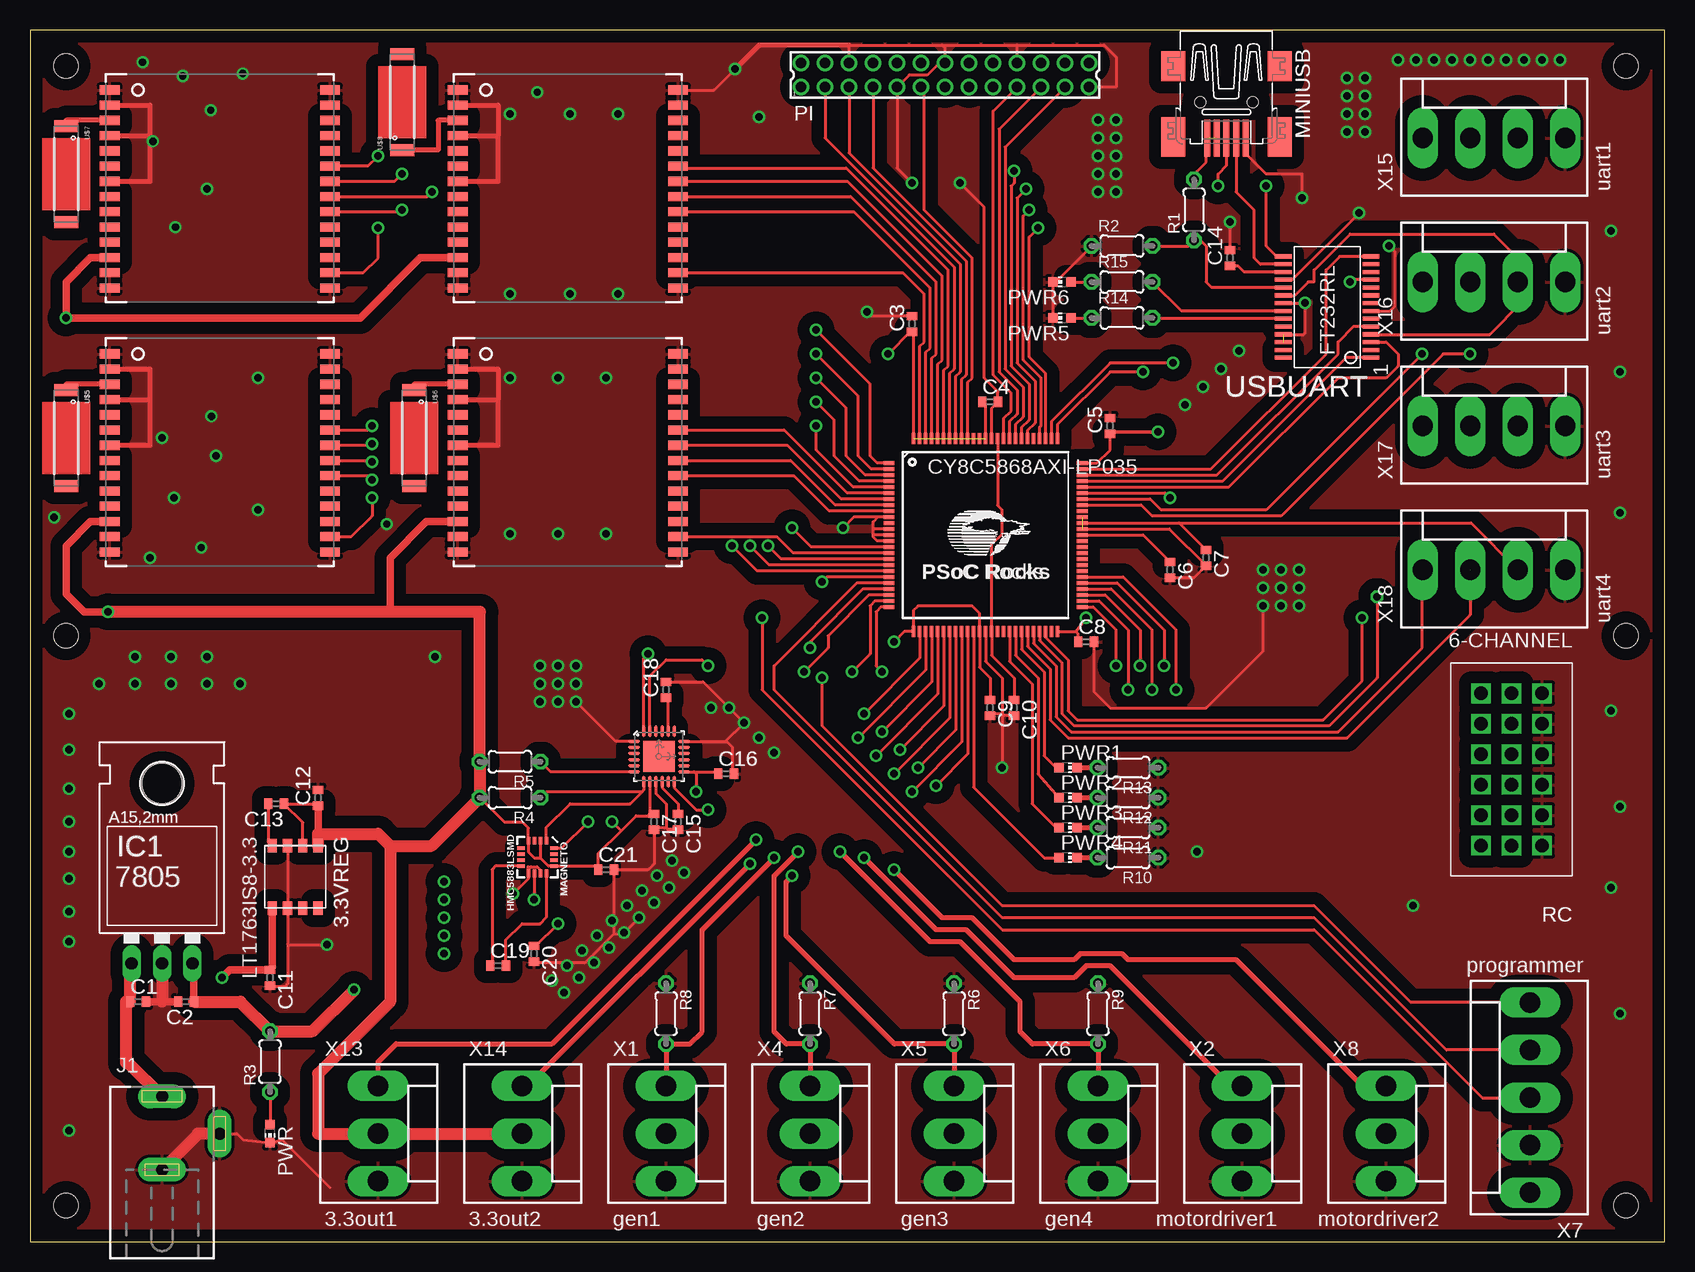
[diagram p9: board, top side]
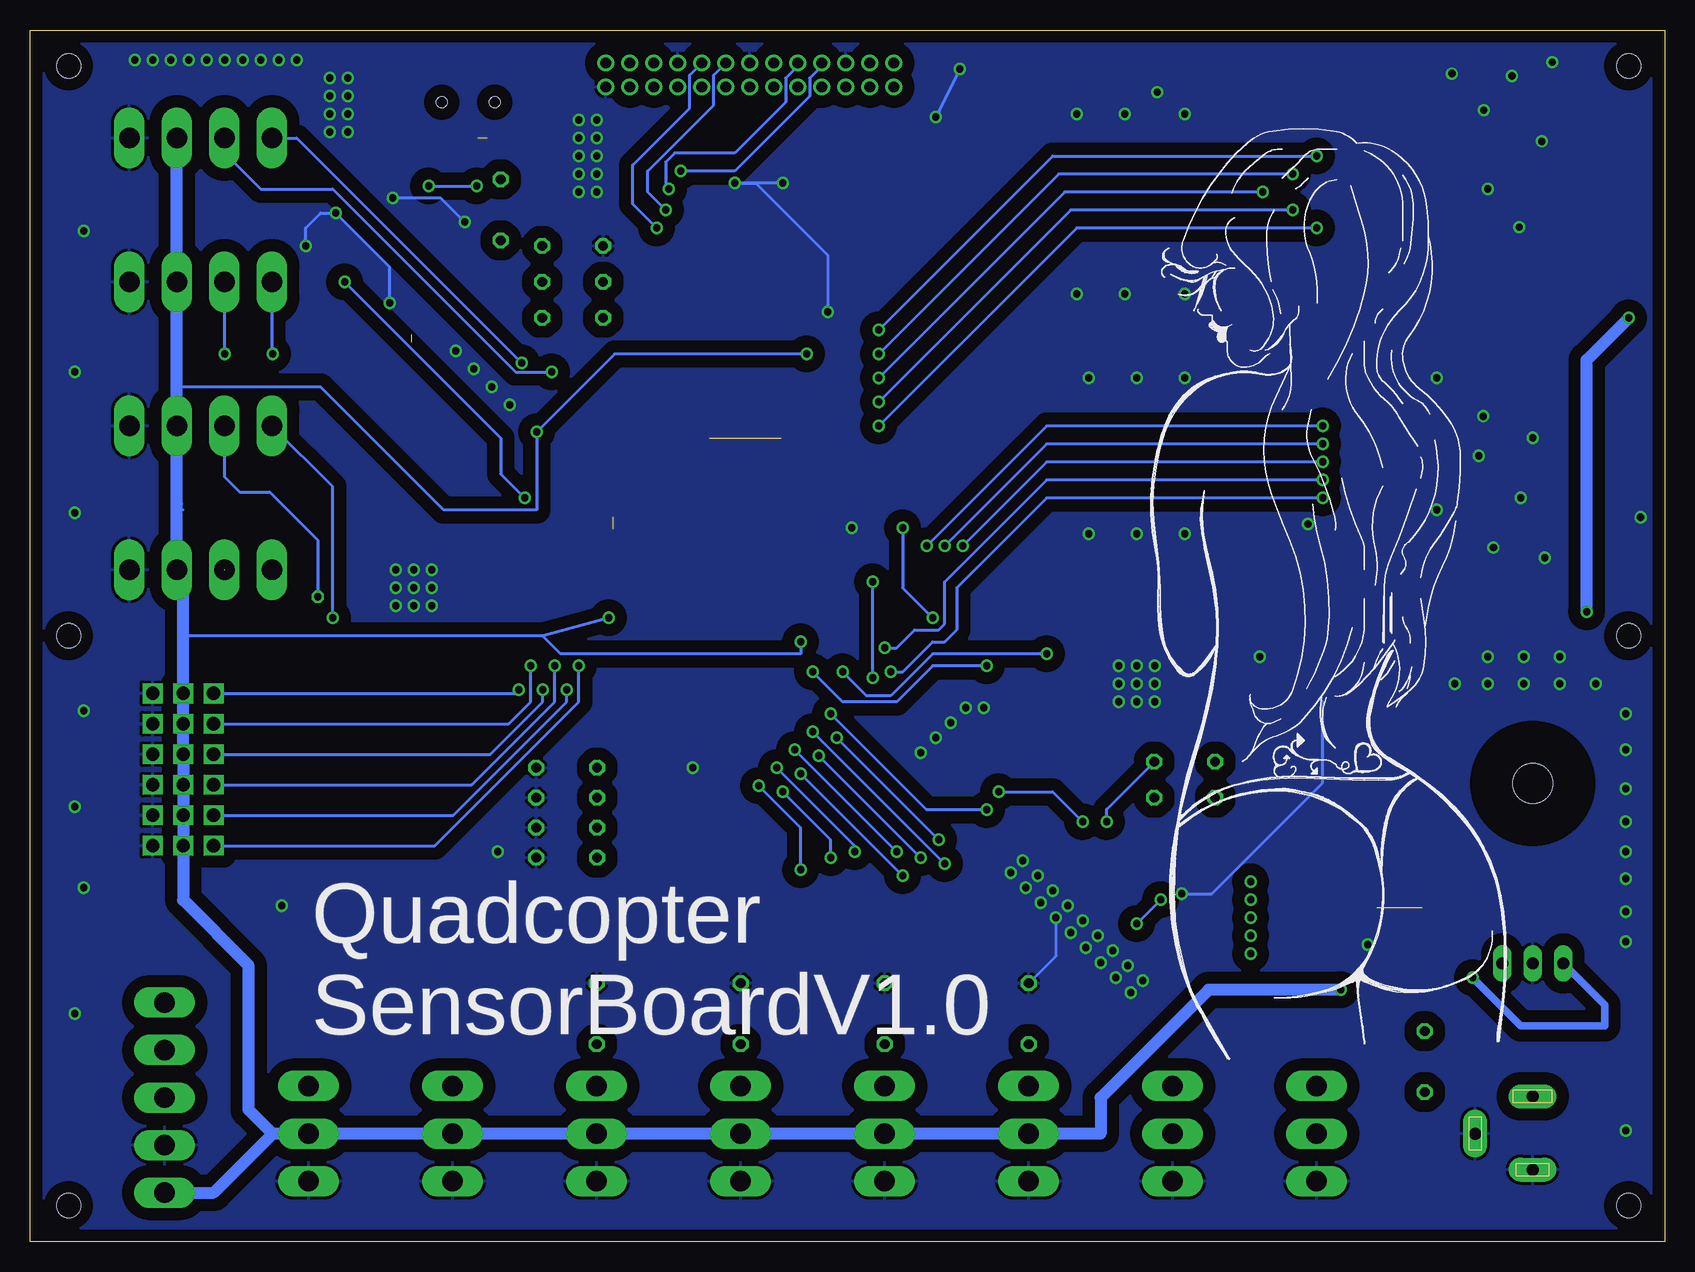
[diagram p10: board, bottom side, seen from below]

Size 136.22 x 101 mm. Coordinates in mm from the lower left corner, seen from the top.
Outline: 0,0 136.22,0 136.22,101 0,101 0,0
Copper layers (1*16): Top 0.035mm / dielectric 1.5mm / Bottom 0.035mm
Design rules "default *": minimum track width 10mil, minimum drill 6mil, track to track 1mil, track to pad 1mil, pad to pad 1mil, via to via 1mil, smd to smd 1mil, copper to edge 40mil, drill to drill 8mil, minimum pad ring 10mil, minimum via ring 8mil, stop-mask expansion 4mil, vias tented up to drill 0mil, thermal gap 10mil
Holes 2 mm at 3,3 3,98 133,98 133,3 133,50.5 3,50.5

### Footprints (pad centres in the part's own frame; a part is rotated, then mirrored left to right if it is on the bottom)
LT1763IS8-SMD = smd 1.143 x 0.762: 1 0,0; 2 0,-1.27; 3 0,-2.54; 4 0,-3.81; 5 5.207,-3.81; 6 5.207,-2.54; 7 5.207,-1.27; 8 5.207,0
QFN-24-TESTING = smd 1.016 x 0.254: 1 -2.066,1.257; 2 -2.066,0.75; 3 -2.066,0.247; 4 -2.066,-0.287; 5 -2.066,-0.792; 6 -2.066,-1.297; 13 2.086,-1.297; 14 2.086,-0.792; 15 2.086,-0.287; 16 2.086,0.247; 17 2.086,0.75; 18 2.086,1.257 | smd 0.254 x 1.016: 7 -1.267,-2.122; 8 -0.762,-2.122; 9 -0.258,-2.122; 10 0.278,-2.122; 11 0.78,-2.122; 12 1.287,-2.122; 19 1.287,2.082; 20 0.78,2.082; 21 0.278,2.082; 22 -0.258,2.082; 23 -0.762,2.082; 24 -1.267,2.082 | smd 2.616 x 2.616: P$1 0.02,-0.01
C0402 = smd 0.7 x 0.9: 1 -0.65,0; 2 0.65,0
TQFP-14X14-100 = smd 0.9 x 0.3: 1 -8.05,6; 2 -8.05,5.5; 3 -8.05,5; 4 -8.05,4.5; 5 -8.05,4; 6 -8.05,3.5; 7 -8.05,3; 8 -8.05,2.5; 9 -8.05,2; 10 -8.05,1.5; 11 -8.05,1; 12 -8.05,0.5; 13 -8.05,0; 14 -8.05,-0.5; 15 -8.05,-1; 16 -8.05,-1.5; 17 -8.05,-2; 18 -8.05,-2.5; 19 -8.05,-3; 20 -8.05,-3.5; 21 -8.05,-4; 22 -8.05,-4.5; 23 -8.05,-5; 24 -8.05,-5.5; 25 -8.05,-6; 51 8.05,-6; 52 8.05,-5.5; 53 8.05,-5; 54 8.05,-4.5; 55 8.05,-4; 56 8.05,-3.5; 57 8.05,-3; 58 8.05,-2.5; 59 8.05,-2; 60 8.05,-1.5; 61 8.05,-1; 62 8.05,-0.5; 63 8.05,0; 64 8.05,0.5; 65 8.05,1; 66 8.05,1.5; 67 8.05,2; 68 8.05,2.5; 69 8.05,3; 70 8.05,3.5; 71 8.05,4; 72 8.05,4.5; 73 8.05,5; 74 8.05,5.5; 75 8.05,6 | smd 0.3 x 0.9: 26 -6,-8.05; 27 -5.5,-8.05; 28 -5,-8.05; 29 -4.5,-8.05; 30 -4,-8.05; 31 -3.5,-8.05; 32 -3,-8.05; 33 -2.5,-8.05; 34 -2,-8.05; 35 -1.5,-8.05; 36 -1,-8.05; 37 -0.5,-8.05; 38 0,-8.05; 39 0.5,-8.05; 40 1,-8.05; 41 1.5,-8.05; 42 2,-8.05; 43 2.5,-8.05; 44 3,-8.05; 45 3.5,-8.05; 46 4,-8.05; 47 4.5,-8.05; 48 5,-8.05; 49 5.5,-8.05; 50 6,-8.05; 76 6,8.05; 77 5.5,8.05; 78 5,8.05; 79 4.5,8.05; 80 4,8.05; 81 3.5,8.05; 82 3,8.05; 83 2.5,8.05; 84 2,8.05; 85 1.5,8.05; 86 1,8.05; 87 0.5,8.05; 88 0,8.05; 89 -0.5,8.05; 90 -1,8.05; 91 -1.5,8.05; 92 -2,8.05; 93 -2.5,8.05; 94 -3,8.05; 95 -3.5,8.05; 96 -4,8.05; 97 -4.5,8.05; 98 -5,8.05; 99 -5.5,8.05; 100 -6,8.05
COPERNICUS = smd 0.762 x 1.651: 1 0,-18.364; 2 1.27,-18.364; 3 2.54,-18.364; 4 3.81,-18.364; 5 5.08,-18.364; 6 6.35,-18.364; 7 7.62,-18.364; 8 8.89,-18.364; 9 10.16,-18.364; 10 11.43,-18.364; 11 12.7,-18.364; 12 13.97,-18.364; 13 15.24,-18.364; 14 16.51,-18.364; 15 16.51,0; 16 15.24,0; 17 13.97,0; 18 12.7,0; 19 11.43,0; 20 10.16,0; 21 8.89,0; 22 7.62,0; 23 6.35,0; 24 5.08,0; 25 3.81,0; 26 2.54,0; 27 1.27,0; 28 0,0
78XXL = drill 1.016 long: GND 0,-3.81; IN -2.54,-3.81; OUT 2.54,-3.81 | hole 3.302: 0,11.176
DCJ0202 = drill 1 pad 2 long: 1 0,3.1; 2 4.8,0; 3 0,-3
16LPCC = smd 0.65 x 0.28: 1 -1.37,0.75; 2 -1.37,0.25; 3 -1.37,-0.25; 4 -1.37,-0.75; 9 1.37,-0.75; 10 1.37,-0.25; 11 1.37,0.25; 12 1.37,0.75 | smd 0.28 x 0.65: 5 -0.75,-1.37; 6 -0.25,-1.37; 7 0.25,-1.37; 8 0.75,-1.37; 13 0.75,1.37; 14 0.25,1.37; 15 -0.25,1.37; 16 -0.75,1.37
32005-201 = smd 3.1 x 0.5: 1 3,1.6; 2 3,0.8; 3 3,0; 4 3,-0.8; 5 3,-1.6 | smd 2.5 x 2: M1 -3,-4.45; M2 -3,4.45 | smd 3.3 x 2: M3 2.9,4.45; M4 2.9,-4.45 | hole 0.9: 0,2.2; 0,-2.2
87758-2616 = drill 0.9 pad 1.27: 1 -12,-1; 2 -12,1; 3 -10,-1; 4 -10,1; 5 -8,-1; 6 -8,1; 7 -6,-1; 8 -6,1; 9 -4,-1; 10 -4,1; 11 -2,-1; 12 -2,1; 13 0,-1; 14 0,1; 15 2,-1; 16 2,1; 17 4,-1; 18 4,1; 19 6,-1; 20 6,1; 21 8,-1; 22 8,1; 23 10,-1; 24 10,1; 25 12,-1; 26 12,1
CHIP-LED0603 = smd 0.8 x 0.8: A 0,-0.75; C 0,0.75
0204/5 = drill 0.813 octagon: 1 -2.54,0; 2 2.54,0
6-CHANNEL = drill 1.1 square: P$1 0,0; P$2 2.54,0; P$3 5.08,0; P$4 0,-2.54; P$5 2.54,-2.54; P$6 5.08,-2.54; P$7 0,-5.08; P$8 2.54,-5.08; P$9 5.08,-5.08; P$10 0,-7.62; P$11 2.54,-7.62; P$12 5.08,-7.62; P$13 0,-10.16; P$14 2.54,-10.16; P$15 5.08,-10.16; P$16 0,-12.7; P$17 2.54,-12.7; P$18 5.08,-12.7
ANTENNA-CHIP4 = smd 1 x 2: NC 4,0; SIG -4,0
SSOP28DB = smd 0.348 x 1.397: 1 -4.225,-3.656; 2 -3.575,-3.656; 3 -2.925,-3.656; 4 -2.275,-3.656; 5 -1.625,-3.656; 6 -0.975,-3.656; 7 -0.325,-3.656; 8 0.325,-3.656; 9 0.975,-3.656; 10 1.625,-3.656; 11 2.275,-3.656; 12 2.925,-3.656; 13 3.575,-3.656; 14 4.225,-3.656; 15 4.225,3.656; 16 3.575,3.656; 17 2.925,3.656; 18 2.275,3.656; 19 1.625,3.656; 20 0.975,3.656; 21 0.325,3.656; 22 -0.325,3.656; 23 -0.975,3.656; 24 -1.625,3.656; 25 -2.275,3.656; 26 -2.925,3.656; 27 -3.575,3.656; 28 -4.225,3.656
KK-156-3 = drill 1.7 pad 2.184 long: 1 -3.96,0; 2 0,0; 3 3.96,0
KK-156-5 = drill 1.7 pad 2.184 long: 1 -7.92,0; 2 -3.96,0; 3 0,0; 4 3.96,0; 5 7.92,0
KK-156-4 = drill 1.7 pad 2.184 long: 1 -5.94,0; 2 -1.98,0; 3 1.98,0; 4 5.94,0

### Placement (x,y rotation side)
3.3VREG  24,33 270 top
ACC  52.41,40.45 0 top
C1  9,20 0 top
C2  13,20 180 top
C3  73.5,76.5 90 top
C4  80,70 0 top
C5  90,68 90 top
C6  95,56 270 top
C7  98,57 270 top
C8  88,50 0 top
C9  80,44.5 270 top
C10  82,44.5 270 top
C11  20,22 270 top
C12  24,37 90 top
C13  20.5,36.5 180 top
C14  100,82 90 top
C15  54,35 270 top
C16  58,39 0 top
C17  52,35 270 top
C18  53,46 90 top
C19  39,23 0 top
C20  42,24 270 top
C21  48,31 0 top
CY8C5868AXI-LP035  79.63,58.9 0 top
GPS1  25,74 270 top
GPS2  25,96 270 top
GPS3  54,74 270 top
GPS4  54,96 270 top
IC1  11,27 0 top
J1  11,9 0 top
MAGNETO  42.29,32.05 270 top
MINIUSB  99.7,94.98 270 top
PI  76.25,97.25 0 top
PWR  20,9 180 top
PWR1  86.5,39.5 270 top
PWR2  86.5,37 270 top
PWR3  86.5,34.5 270 top
PWR4  86.5,32 270 top
PWR5  86,77 90 top
PWR6  86,80 90 top
R1  97,86 90 top
R2  91,83 0 top
R3  20,15 90 top
R4  40,37 180 top
R5  40,40 180 top
R6  77,19 270 top
R7  65,19 270 top
R8  53,19 270 top
R9  89,19 270 top
R10  91.5,32 180 top
R11  91.5,34.5 180 top
R12  91.5,37 180 top
R13  91.5,39.5 180 top
R14  91,77 0 top
R15  91,80 0 top
RC  126,33 180 top
U$5  3,67 270 top
U$6  32,67 270 top
U$7  3,89 270 top
U$8  31,95 90 top
USBUART  108.1,77.9 90 top
X1  53,9 270 top
X2  101,9 270 top
X4  65,9 270 top
X5  77,9 270 top
X6  89,9 270 top
X7  125,12 90 top
X8  113,9 270 top
X13  29,9 270 top
X14  41,9 270 top
X15  122,92 0 top
X16  122,80 0 top
X17  122,68 0 top
X18  122,56 0 top

### Tracks (layer width: path | path; a pad name or v marks a point on that pad's centre or on a via)
+3.3V  (via drill 0.6)
  Top 0.254: R4.2 37.5,37 39.5,35 41,35 41.54,34.46 MAGNETO.4 41.54,32.46 42,32 42.5,32 | 42.5,32 43.2,31.3 MAGNETO.13 47.05,31.3 C21.1 47.35,32.35 49.25,34.25 | MAGNETO.2 42.54,32.04 42.5,32 | 49.25,34.25 50.5,35.5 51.5,35.5 | 51.5,35.5 51.85,35.5 C17.1 | ACC.8 51.65,35.65 51.5,35.5 | C16.1 57.2,39.15 ACC.13 55.35,39.15 55.5,39 v55.5,37.5 | v48.5,35 49.25,34.25 | C12.1 23.85,36.5 C13.1 22.73,34.92 3.3VREG.2 | 30,52.75 29.75,52.5
  Top 0.61: C12.1 24,34 | GPS4.12 32.53,82.03 27.5,77 v3,77 3,80 5.03,82.03 GPS2.12 | GPS1.12 5.03,60.03 3,58 3,54 4.5,52.5 v6.5,52.5 | GPS3.12 33.03,60.03 30,57 30,52.5
  Top 1.016: X14.2 X13.2 24,9 24,14 30,20 30,33 | 3.3VREG.1 24,34 29,34 30,33 | 30,33 33.46,33 R4.2 R5.2 37.46,52.46 37.5,52.5 30,52.5 29.75,52.5 v6.5,52.5
  Bottom 0.254: v55.5,37.5 51,37.5 v48.5,35
  Bottom 1.016: v6.5,52.5 6.5,73.5 v3,77
+5V  (via drill 0.6)  (1 unrouted)
  Top 0.254: C5.1 90,66 88.9,64.9 CY8C5868AXI-LP035.75 | USBUART.4 121.62,75.62 123,77 123,77.02 123.98,78 X16.3 123.98,82 121.98,84 110,84 107,81 107,80 106.5,80 105.38,78.88 USBUART.20 | C7.1 95.75,59.9 CY8C5868AXI-LP035.65 120.08,59.9 X18.3 | CY8C5868AXI-LP035.88 79.63,69.72 C4.1 | CY8C5868AXI-LP035.100 73.63,75.72 C3.1 73.35,75.85 v71.5,74 | C5.1 90.15,67.5 v94,67.5 90,67.5 C5.1 | CY8C5868AXI-LP035.50 87.15,50.85 | 87.15,50.85 v88,52 | v72,50 72.85,50.85 CY8C5868AXI-LP035.26 73.63,52.63 74,53 78.5,53 79.13,52.37 CY8C5868AXI-LP035.37 79.13,47.87 80,47 C9.1 80.13,45.28 80.13,45.13 80,45 | C8.1 87.35,50.65 87.15,50.85
  Top 0.61: C2.1 13.65,23.08 IC1.OUT
  Top 1.016: C2.1 17.54,20 R3.2 23.54,17.54 v27,21
  Bottom 0.254: v71.5,74 87.5,74 v94,67.5 94,61 101.75,61 112,71.25 123.98,71.25 | 123.48,61 123.98,61.5 | v88,52 93.5,50.5 | 93.5,50.5 123.46,50.5 | v72,50 72,49 92,49 93.5,50.5
  Bottom 1.016: v27,21 38,21 47,12 47,9 X1.2 X4.2 X5.2 X6.2 X2.2 X8.2 116,9 | X7.1 120.92,4.08 116,9 | 116,9 118,11 118,23 123.46,28.46 RC.P$2 RC.P$5 RC.P$8 RC.P$11 RC.P$14 RC.P$17 123.46,50.5 123.46,55.48 X18.3 123.98,61.5 X17.3 123.98,71.25 X16.3 X15.3
+12V  (via drill 0.6)  (1 unrouted)
  Top 0.61: 3.3VREG.5 20.19,22.84 C11.1 16.65,22.65 v16,22
  Top 1.016: 8,19.65 C1.1 | C1.1 8.35,23.08 IC1.IN | J1.1 8.2,14.9 8,14.9 8,20 C1.1
  Bottom 0.61: v16,22 12,18 5,18 5,19.73 IC1.IN
AUXCL1
  Top 0.254: ACC.7 51.14,37.64 51,37.5 | 51,37.5 43.04,37.5 R4.1 | MAGNETO.1 43.04,34.54 45,36.5 50,36.5 51,37.5
AUXDA1  (via drill 0.6)
  Top 0.254: ACC.6 43.39,39.15 R5.1 | MAGNETO.16 44.3,32.8 v46.5,35
  Bottom 0.254: v46.5,35 46.5,36.04 R5.1
CH1  (via drill 0.6)
  Top 0.254: CY8C5868AXI-LP035.51 88.6,52.9 90.5,51 v90.5,48
  Bottom 0.254: RC.P$3 102.5,33 90.5,45 v90.5,48
CH2  (via drill 0.6)
  Top 0.254: CY8C5868AXI-LP035.52 89.1,53.4 91.5,51 v91.5,46
  Bottom 0.254: RC.P$6 100.96,35.54 91.5,45 v91.5,46
CH3  (via drill 0.6)
  Top 0.254: CY8C5868AXI-LP035.53 89.6,53.9 92.5,51 v92.5,48
  Bottom 0.254: RC.P$9 99.42,38.08 92.5,45 v92.5,48
CH4  (via drill 0.6)
  Top 0.254: CY8C5868AXI-LP035.54 90.1,54.4 93.5,51 v93.5,46
  Bottom 0.254: RC.P$12 97.88,40.62 93.5,45 v93.5,46
CH5  (via drill 0.6)
  Top 0.254: CY8C5868AXI-LP035.55 90.6,54.9 94.5,51 v94.5,48
  Bottom 0.254: RC.P$15 96.34,43.16 94.5,45 v94.5,48
CH6  (via drill 0.6)
  Top 0.254: CY8C5868AXI-LP035.56 91.1,55.4 95.5,51 v95.5,46
  Bottom 0.254: RC.P$18 95.8,45.7 v95.5,46
CTS#  (via drill 0.6)
  Top 0.254: USBUART.11 110.17,80.17 v110,80 | CY8C5868AXI-LP035.70 94.6,62.4 v95,62
  Bottom 0.254: v110,80 97,67 97,64 v95,62
D+  (via drill 0.6)
  Top 0.254: USBUART.15 103.88,82.12 103,83 v103,88 | v99,88 99,89 99.7,89.7 MINIUSB.3
  Bottom 0.254: v103,88 v99,88
D-
  Top 0.254: USBUART.16 102.53,81.47 102,82 102,86 100.5,87.5 MINIUSB.2
GEN1  (via drill 0.6)
  Top 0.254: v70.5,40.5 75.63,45.63 CY8C5868AXI-LP035.30
  Top 0.406: v62,32 56,26 56,17.5 54.96,16.46 R8.2 X1.1
  Bottom 0.254: v62,32 v70.5,40.5
GEN2  (via drill 0.6)
  Top 0.254: v72.5,41 76.13,44.63 CY8C5868AXI-LP035.31
  Top 0.406: v64,32.5 62,30.5 62,17.5 63.04,16.46 R7.2 X4.1
  Bottom 0.254: v64,32.5 v72.5,41
GEN3  (via drill 0.6)
  Top 0.254: v72,39 76.63,43.63 CY8C5868AXI-LP035.32
  Top 0.406: X5.1 R6.2 72.04,16.46 63,25.5 63,30 v63.5,30.5
  Bottom 0.254: v63.5,30.5 v72,39
GEN4  (via drill 0.6)
  Top 0.254: v74,39.5 77.13,42.63 CY8C5868AXI-LP035.33
  Top 0.406: X6.1 R9.2 83.54,16.46 82.5,17.5 82.5,20 77.5,25 75,25 v67.5,32.5
  Bottom 0.254: v67.5,32.5 67.5,33 v74,39.5
GEN5  (via drill 0.6)
  Top 0.254: v69,42 74.63,47.63 CY8C5868AXI-LP035.28
  Top 0.406: X13.1 29,15 30.5,16.5 43.5,16.5 v60.5,33.5
  Bottom 0.254: v60.5,33.5 v69,42
GEN6  (via drill 0.6)
  Top 0.254: v71,42.5 75.13,46.63 CY8C5868AXI-LP035.29
  Top 0.406: X14.1 41.46,12.96 v60,31.5
  Bottom 0.254: v60,31.5 v71,42.5
GND  (via drill 0.6)  (2 unrouted)
  Top 0.254: C14.2 v100,85 | v106,87 106,89 103,89 101.3,90.7 MINIUSB.1 | CY8C5868AXI-LP035.64 94.95,59.4 C7.2 97,55.35 C6.2 | ACC.9 52.15,37.35 53,36.5 53,34.5 | 53,34.5 52.15,34.5 C17.2 52,31.5 51.5,31 C21.2 48.65,25.65 | C15.2 53.15,34.35 53,34.5 | CY8C5868AXI-LP035.87 80.13,69.48 C4.2 80.65,70.85 79.5,72 79.5,86.25 v77.5,88.25 | 3.3VREG.3 3.3VREG.6 21.46,24.79 | 81,44 80.15,44 C9.2 | C10.2 81.15,43.85 81,44 | CY8C5868AXI-LP035.38 79.63,48.37 81,47 81,44 | USBUART.25 106.12,75.62 106.25,75.75 v106.25,78.25 106.22,78.22 USBUART.21 | USBUART.18 105.17,80.17 v110.75,85.75 | USBUART.7 113.33,77.58 113.75,78 113.75,82.5 v113.25,83 | C8.2 88.65,45.85 90,44.5 98,44.5 102.75,49.25 v102.75,53 | 81,44 v81,39.5 | C3.2 70.1,77.15 v69.75,77.5 | 21.46,24.79 21.5,24.75 v24.75,24.75 | 21.46,24.79 21.46,21.46 21.25,21.25 20.1,21.25 C11.2 | CY8C5868AXI-LP035.14 70.6,58.4 70.25,58.75 70.25,59 | 70.25,59 70.25,59.5 | 70.25,59.5 70.25,60 70.65,60.4 CY8C5868AXI-LP035.10 68.65,60.4 v67.75,59.5 | CY8C5868AXI-LP035.13 70.35,58.9 70.25,59 | CY8C5868AXI-LP035.12 70.35,59.4 70.25,59.5 | PI.6 68.25,99.75 76,99.75 | 76,99.75 82.25,99.75 | 82.25,99.75 89.5,99.75 90.5,98.75 90.5,96.25 PI.25 | 76,99.75 76.25,99.5 PI.14 75.75,98.25 74.75,97.25 73.25,97.25 PI.9 72.25,89.5 v73.5,88.25 | PI.20 82.25,99.75 | GPS4.28 57,96 v58.75,97.75 | ACC.1 48.79,41.71 v45.5,45 | 48.65,25.65 46.25,23.25 42.1,23.25 C20.2 | 48.65,25.65 49.4,25.65 v49.5,25.75 v50.75,27 | C16.2 58.5,39.15 58.5,41.25 58.04,41.71 ACC.18 57.96,41.71 v59.5,43.25 v58.25,44.5 56.1,46.65 C18.2 | MAGNETO.11 42.54,30.96 42.25,31.25 41.5,31.25 41.5,31 | 41.54,31.04 MAGNETO.9 41.54,30.96 41.5,31
  Top 0.254: 41.54,31.04 41.75,31.25 | 41.54,31.04 41.5,31 | 41.5,31 41.5,30.25 v40.25,29 | J1.2 17.25,9 17.75,8.5 PWR.C 21,8.5 25,4.5 | PWR5.C PWR6.C 85.5,80.04 R2.1
  Top 0.406: 68.25,99.75 60.75,99.75 59,98 | GPS1.7 10,66.38 10,70.19 | GPS1.4 10,70.19 | 10,70.19 10,72.73 GPS1.2 | GPS2.7 10,88.38 10,92.19 | GPS2.4 10,92.19 | 10,92.19 10,94.73 GPS2.2 | GPS4.7 39,88.38 39,92.19 | GPS4.4 39,92.19 | GPS4.2 39,94.73 39,92.19 | GPS3.7 39,66.38 39,70.19 | GPS3.4 39,70.19 | GPS3.2 39,72.73 39,70.19
  Top 0.61: C1.2 11,20 C2.2
  Top 1.016: IC1.GND 11,20 | J1.2 14,9 J1.3
  Bottom 0.254: v100,85 102,87 v106,87 | v106.25,78.25 106.25,81.25 v110.75,85.75 112,85.75 113.25,84.5 v113.25,83 | v69.75,77.5 69.75,82.25 75.75,88.25 v77.5,88.25 v73.5,88.25 | v58.75,97.75 v60.75,93.75 | v40.25,29 37.75,29 28.5,38.25 28.5,45 28.75,45.25 | v50.75,27 50.75,23.79 R8.1
  other vias: 33.75,48.75 3.25,9.25 97.25,32.5 115.25,28 132.5,36.25 14.75,87.75 15.5,65.5 45,94 127.5,98.5 2.01,60.38 15.12,68.8 14.27,57.86 15.07,94.31 12.12,84.57 12.73,97.16 9.38,98.32 17.72,97.37 10.24,91.72 42.27,95.82 29.72,59.82 11,67 19,72 12,62 19,61 10,57 40,59 44,59 48,59 40,72 44,72 48,72 40,79 45,79 49,79 40,94 49,94 14.75,48.75 11.75,48.75 8.75,48.75 17.5,46.5 14.75,46.5 11.75,46.5 8.75,46.5 5.75,46.5 3.25,44 3.25,41 3.25,37.75 3.25,35 3.25,32.5 3.25,30.25 3.25,27.5 3.25,25 132.5,19 131.75,29.5 131.75,44.25 132.5,60.75 132.5,72.5 131.75,84.25 102.75,56 105.75,53 105.75,56 104.25,54.5 105.75,54.5 104.25,53 102.75,54.5 104.25,56 100.75,74.25 99.25,72.75 97.75,71.25 96.25,69.75 89,93.5 90.5,93.5 90.5,87.5 89,87.5 89,89 90.5,89 89,90.5 90.5,90.5 89,92 90.5,92 109.75,92.5 111.25,92.5 109.75,94 111.25,94 109.75,95.5 111.25,95.5 109.75,97 111.25,97 114,98.5 115.5,98.5 117,98.5 118.5,98.5 120,98.5 121.5,98.5 123,98.5 124.5,98.5 126,98.5 44,45 42.5,45 42.5,46.5 44,46.5 45.5,46.5 45.5,48 44,48 42.5,48 44.5,20.75 43.5,21.75 45.75,22 44.75,23 46,24.25 47,23.25 47.25,25.5 48.25,24.5 48.5,26.75 49.75,28 51,29.25 52,28.25 53.25,29.5 52.25,30.5 53.5,31.75 54.5,30.75 62,40.75 60.75,42 56.75,44.5
  pour Bottom (isolate 1.016): 0,101 136.25,101 136.25,0 0,0
  pour Top (isolate 1.016): 0,101 136.25,101 136.25,0 0,0
GPIO2(0)
  Top 0.254: PI.3 66.25,92 77,81.25 77,72.75 76.63,72.38 CY8C5868AXI-LP035.94
GPIO3(1)
  Top 0.254: PI.5 68.25,90.75 77.5,81.5 77.5,72.5 77.13,72.13 CY8C5868AXI-LP035.93
GPIO4
  Top 0.254: PI.7 70.25,89.5 78,81.75 78,72.25 77.63,71.88 CY8C5868AXI-LP035.92
GPIO9
  Top 0.254: PI.21 80.75,92.75 80.75,72.5 82.25,71 82.25,69 81.63,68.38 CY8C5868AXI-LP035.84
GPIO10
  Top 0.254: CY8C5868AXI-LP035.85 81.13,68.63 81.75,69.25 81.75,70.75 80.25,72.25 80.25,94.25 PI.19
GPIO11
  Top 0.254: PI.23 81.25,91.25 81.25,72.75 82.75,71.25 82.75,68.75 82.13,68.13 CY8C5868AXI-LP035.83
GPIO14  (via drill 0.6)
  Top 0.254: v82,89.25 82,88.25 81.75,88 81.75,73 83.25,71.5 83.25,68.5 82.63,67.88 CY8C5868AXI-LP035.82
  Bottom 0.254: PI.8 70.25,98 71.25,97 71.25,95.5 77.5,89.25 v82,89.25
GPIO15  (via drill 0.6)
  Top 0.254: v83,87.75 82.25,87 82.25,73.25 83.75,71.75 83.75,68.25 83.13,67.63 CY8C5868AXI-LP035.81
  Bottom 0.254: PI.10 72.25,98 73.25,97 73.25,95 77.5,90.75 82.5,90.75 83.25,90 83.25,88 v83,87.75
GPIO17
  Top 0.254: CY8C5868AXI-LP035.91 78.13,71.63 78.5,72 78.5,82 74.5,86 74.5,96 PI.11
GPIO23  (via drill 0.6)
  Top 0.254: CY8C5868AXI-LP035.79 84.13,67.88 84.25,68 84.25,72 82.75,73.5 82.75,85.5 v83.25,86
  Bottom 0.254: v83.25,86 84.75,87.5 84.75,89.25 79.25,94.75 79.25,97.25 PI.16
GPIO24  (via drill 0.6)
  Top 0.254: CY8C5868AXI-LP035.78 84.63,72.37 83.25,73.75 83.25,83.75 v84,84.5
  Bottom 0.254: v84,84.5 86,86.5 86,89.75 81.25,94.5 81.25,97.25 PI.18
GPS1RXA  (via drill 0.6)
  Top 0.254: CY8C5868AXI-LP035.19 60.6,55.9 v58.5,58 | GPS1.21 28.39,65.11 v28.5,65
  Bottom 0.254: v28.5,65 51.5,65 v58.5,58
GPS1RXB  (via drill 0.6)
  Top 0.254: CY8C5868AXI-LP035.22 69.4,54.4 65,50 v65,49.5 | GPS1.20 28.16,63.84 v28.5,63.5
  Bottom 0.254: v65,49.5 64,49.5 62.5,51 60.5,51 60,51.5 60,55 51.5,63.5 v28.5,63.5
GPS1TXA  (via drill 0.6)
  Top 0.254: CY8C5868AXI-LP035.17 62.6,56.9 v61.5,58 | GPS1.23 28.15,67.65 v28.5,68
  Bottom 0.254: v28.5,68 51.5,68 v61.5,58
GPS1TXB  (via drill 0.6)
  Top 0.254: CY8C5868AXI-LP035.18 61.6,56.4 v60,58 | GPS1.22 28.38,66.38 v28.5,66.5
  Bottom 0.254: v28.5,66.5 51.5,66.5 v60,58
GPS1XSTB  (via drill 0.6)
  Top 0.254: CY8C5868AXI-LP035.23 69.9,53.9 66.5,50.5 66.5,49.5 v64.5,47.5 | GPS1.16 26.76,58.76 28.5,60.5 v28.5,62
  Bottom 0.254: v64.5,47.5 63.5,47.5 61,50 60,50 59,51 59,54.5 51.5,62 v28.5,62
GPS2RXA  (via drill 0.6)
  Top 0.254: CY8C5868AXI-LP035.3 69.6,63.9 68,65.5 68,69.5 v65.5,72 | GPS2.21 33.11,87.11 v33.5,87.5
  Bottom 0.254: v33.5,87.5 50,87.5 v65.5,72
GPS2RXB  (via drill 0.6)
  Top 0.254: CY8C5868AXI-LP035.4 69.1,63.4 67,65.5 67,68.5 v65.5,70 | GPS2.20 30.84,85.84 v31,86
  Bottom 0.254: v65.5,70 49.5,86 v31,86
GPS2TXA  (via drill 0.6)
  Top 0.254: CY8C5868AXI-LP035.1 70.6,64.9 70,65.5 70,71.5 v65.5,76 | GPS2.23 28.15,89.65 v29,90.5
  Bottom 0.254: v29,90.5 51,90.5 v65.5,76
GPS2TXB  (via drill 0.6)
  Top 0.254: CY8C5868AXI-LP035.2 70.1,64.4 69,65.5 69,70.5 v65.5,74 | GPS2.22 30.38,88.38 v31,89
  Bottom 0.254: v31,89 50.5,89 v65.5,74
GPS2XSTB  (via drill 0.6)
  Top 0.254: CY8C5868AXI-LP035.5 68.6,62.9 65.5,66 v65.5,68 | GPS2.16 27.76,80.76 29,82 v29,84.5
  Bottom 0.254: v65.5,68 49,84.5 v29,84.5
GPS3RXA
  Top 0.254: GPS3.21 63.39,65.11 67.1,61.4 CY8C5868AXI-LP035.8
GPS3RXB
  Top 0.254: CY8C5868AXI-LP035.9 66.6,60.9 63.66,63.84 GPS3.20
GPS3TXA
  Top 0.254: GPS3.23 62.85,67.65 68.1,62.4 CY8C5868AXI-LP035.6
GPS3TXB
  Top 0.254: GPS3.22 63.12,66.38 67.6,61.9 CY8C5868AXI-LP035.7
GPS3XSTB
  Top 0.254: GPS3.16 62.24,58.76 63.6,57.4 CY8C5868AXI-LP035.16
GPS4RXA
  Top 0.254: GPS4.21 68.39,87.11 75.5,80 75.5,74 75.13,73.63 CY8C5868AXI-LP035.97
GPS4RXB
  Top 0.254: GPS4.20 68.66,85.84 75,79.5 75,74.5 74.63,74.13 CY8C5868AXI-LP035.98
GPS4TXA
  Top 0.254: GPS4.23 54,89.5 68,89.5 76.5,81 76.5,73 76.13,72.63 CY8C5868AXI-LP035.95
GPS4TXB
  Top 0.254: GPS4.22 68.12,88.38 76,80.5 76,73.5 75.63,73.13 CY8C5868AXI-LP035.96
GPS4XSTB
  Top 0.254: GPS4.16 72.74,80.76 74.5,79 74.5,75 74.13,74.63 CY8C5868AXI-LP035.99
INT1  (via drill 0.6)
  Top 0.254: ACC.12 53.7,37.8 55.5,36 v56.5,36 | v69.5,44 74.13,48.63 CY8C5868AXI-LP035.27
  Bottom 0.254: v56.5,36 61.5,36 v69.5,44
MDTX1  (via drill 0.6)
  Top 0.254: v73.5,37.5 77.63,41.63 CY8C5868AXI-LP035.34
  Top 0.406: X2.1 100.04,12.96 90,23 88,23 87,22 82,22 78,26 75.5,26 v69.5,32
  Bottom 0.254: v69.5,32 69.5,33.5 v73.5,37.5
MDTX2  (via drill 0.6)
  Top 0.254: v75.5,38 78.13,40.63 CY8C5868AXI-LP035.35
  Top 0.406: X8.1 111.04,12.96 100.5,23.5 91.5,23.5 91,24 87.5,24 87,23.5 82,23.5 78.5,27 76,27 v72,31
  Bottom 0.254: v72,31 72,34.5 v75.5,38
N$1
  Top 0.254: CY8C5868AXI-LP035.63 92.75,58.9 C6.1
N$2
  Top 0.254: C13.2 19.85,33.34 3.3VREG.4
N$3
  Top 0.406: GPS1.3 3,71.46 U$5.SIG
N$4
  Top 0.254: R3.1 PWR.A
N$5
  Top 0.254: C14.1 100.65,81.35 101.17,80.83 USBUART.17
N$6  (1 unrouted)
  Top 0.254: R1.2 97,89 98,90 98,91.88 MINIUSB.5
N$7
  Top 0.254: ACC.10 52.69,37.81 54,36.5 C15.1
N$8
  Top 0.254: ACC.20 53.19,45.16 C18.1
N$9
  Top 0.406: R10.2 PWR4.C
N$10
  Top 0.406: GPS2.3 3,93.46 U$7.SIG
N$11
  Top 0.254: C19.2 39.65,25.15 41,26.5 42.5,26.5 43.04,27.04 MAGNETO.12
N$12
  Top 0.406: GPS3.3 32,71.46 U$6.SIG
N$13
  Top 0.406: GPS4.3 34,93.46 34,91 U$8.SIG
N$14  (via drill 0.6)
  other vias: 34.5,30
N$15
  Top 0.254: MAGNETO.8 38.8,31.3 38.5,31 38.5,23.15 C19.1
N$16  (via drill 0.6)
  Top 0.254: C20.1 42.15,24.65 v44,26.5 | MAGNETO.10 42.04,28.54 v42,28.5
  Bottom 0.254: v44,26.5 v42,28.5
N$17
  Top 0.406: R11.2 PWR3.C
N$18
  Top 0.406: R12.2 PWR2.C
N$19
  Top 0.406: R13.2 PWR1.C
N$20
  Top 0.254: PWR5.A R14.1
N$21
  Top 0.254: PWR6.A R15.1
N$22  (via drill 0.6)
  other vias: 34.5,28.5
N$23  (via drill 0.6)
  other vias: 34.5,27
N$24  (via drill 0.6)
  other vias: 34.5,25.5
N$25  (via drill 0.6)
  other vias: 34.5,24
PWREN#
  Top 0.254: CY8C5868AXI-LP035.74 98.4,64.4 108,74 108,81 109.12,82.12 USBUART.14
RTS#
  Top 0.254: USBUART.3 112.97,74.97 113,75 114,74 114,73 113,72 109,72 99.9,62.9 CY8C5868AXI-LP035.71
RX1  (via drill 0.6)
  Top 0.254: v95.25,73.25 90,73.25 85.13,68.38 CY8C5868AXI-LP035.77
  Bottom 0.254: X15.1 114,92 v95.25,73.25
RX2  (via drill 0.6)
  Top 0.254: v116,74 103,61 94.25,61 93.35,61.9 CY8C5868AXI-LP035.69
  Bottom 0.254: X16.1 116.06,74.06 v116,74
RX3  (via drill 0.6)
  Top 0.254: CY8C5868AXI-LP035.48 84.63,50.37 86.5,48.5 86.5,44.25 87.25,43.5 107.75,43.5 111,46.75 v111,52
  Bottom 0.254: v111,52 111,62.94 X17.1
RX4
  Top 0.254: CY8C5868AXI-LP035.46 83.63,49.87 85.5,48 85.5,43.75 86.75,42.5 109,42.5 116,49.5 116,55.94 X18.1
RXLED
  Top 0.254: USBUART.22 95.97,77.58 R15.2
SCL_ACC  (via drill 0.6)
  Top 0.254: ACC.23 51.65,47.15 53,48.5 56,48.5 v56.5,48 | CY8C5868AXI-LP035.25 70.9,52.9 70.5,52.5 70.5,48 v71,47.5
  Bottom 0.254: v56.5,48 61,48 64,45 68.5,45 v71,47.5
SCLK
  Top 0.254: X7.4 118.04,15.96 107,27 81,27 62,46 62,48 68.9,54.9 CY8C5868AXI-LP035.21
SDA_ACC  (via drill 0.6)
  Top 0.254: ACC.24 51.14,48.64 v51.5,49 | CY8C5868AXI-LP035.24 70.4,53.4 70,53 70,49 v68.5,47.5
  Bottom 0.254: v51.5,49 61,49 64.5,45.5 66.5,45.5 v68.5,47.5
SDAT  (via drill 0.6)
  Top 0.254: X7.5 115.08,19.92 107,28 81,28 66,43 v66,47 | CY8C5868AXI-LP035.20 66.4,55.4 v66,55
  Bottom 0.254: v66,47 v66,55
STATUS1
  Top 0.254: CY8C5868AXI-LP035.44 82.63,49.37 84.5,47.5 84.5,40.5 85.5,39.5 PWR1.A
STATUS2
  Top 0.254: CY8C5868AXI-LP035.43 82.13,48.87 84,47 84,39 PWR2.A
STATUS3
  Top 0.254: CY8C5868AXI-LP035.42 81.63,48.37 83.5,46.5 83.5,36.5 85.5,34.5 PWR3.A
STATUS4
  Top 0.254: CY8C5868AXI-LP035.36 78.63,37.87 84.5,32 PWR4.A
TX1  (via drill 0.6)
  Top 0.254: v92.75,72.5 90,72.5 85.63,68.13 CY8C5868AXI-LP035.76
  Bottom 0.254: X15.2 120.02,90.77 117,87.75 111,87.75 95.75,72.5 v92.75,72.5
TX2  (via drill 0.6)
  Top 0.254: v120,74 117.75,74 104.25,60.5 93.5,60.5 92.6,61.4 CY8C5868AXI-LP035.68
  Bottom 0.254: X16.2 120.02,74.02 v120,74
TX3  (via drill 0.6)
  Top 0.254: v112.25,53.75 112.25,47 108.25,43 87,43 86,44 86,48.25 84.13,50.12 CY8C5868AXI-LP035.47
  Bottom 0.254: X17.2 120.02,63.77 118.75,62.5 116.25,62.5 112.25,58.5 v112.25,53.75
TX4  (1 unrouted)
  Top 0.254: CY8C5868AXI-LP035.45 83.13,49.62 85,47.75 85,43.5 86.5,42 109.75,42 120,52.25 120,55.98
TXLED
  Top 0.254: USBUART.23 93.61,76.92 R14.2
USB_RESET
  Top 0.254: R2.2 96.54,83 R1.1 97.54,83.46 98,83 98,80 98.47,79.53 USBUART.19
USB_RXD
  Top 0.254: CY8C5868AXI-LP035.73 98.9,63.9 109,74 109,75 110.28,76.28 USBUART.5
USB_TXD
  Top 0.254: CY8C5868AXI-LP035.72 99.4,63.4 109.67,73.67 USBUART.1
VCCD
  Top 0.254: CY8C5868AXI-LP035.86 80.63,61.37 81,61 81,59 80.13,58.13 CY8C5868AXI-LP035.39 80.13,48.87 82,47 C10.1
XRES  (via drill 0.6)
  Top 0.254: v61,52 61,46 81,26 107,26 121,12 X7.3 | CY8C5868AXI-LP035.15 65.1,57.9 v63.5,59.5
  Bottom 0.254: v63.5,59.5 63.5,54.5 v61,52
(copper drawn outside any net)
  shapes: Top area x4

### Text on the board
_tsilk: MINIUSB | 1 | PI | uart1 | R1 | C3 | uart2 | FT232RL | USBUART | U$5 | C4 | C5 | uart3 | C7 | C6 | PSoC Rocks | uart4 | C8 | 6-CHANNEL | C18 | C9 | C10 | C16 | C13 | C12 | C17 | C15 | A15,2mm | 3.3VREG | HMC5883LSMD | MAGNETO | IC1 | C21 | 7805 | RC | C20 | C19 | programmer | C11 | C1 | R8 | R7 | R6 | R9 | C2 | R3 | 3.3out1 | 3.3out2 | gen1 | gen2 | gen3 | gen4 | motordriver1 | motordriver2
_bsilk: Quadcopter / SensorBoardV1.0